# EAGLE design circuit (EAGLE 8.4.3)

## Sheet 1 of 4
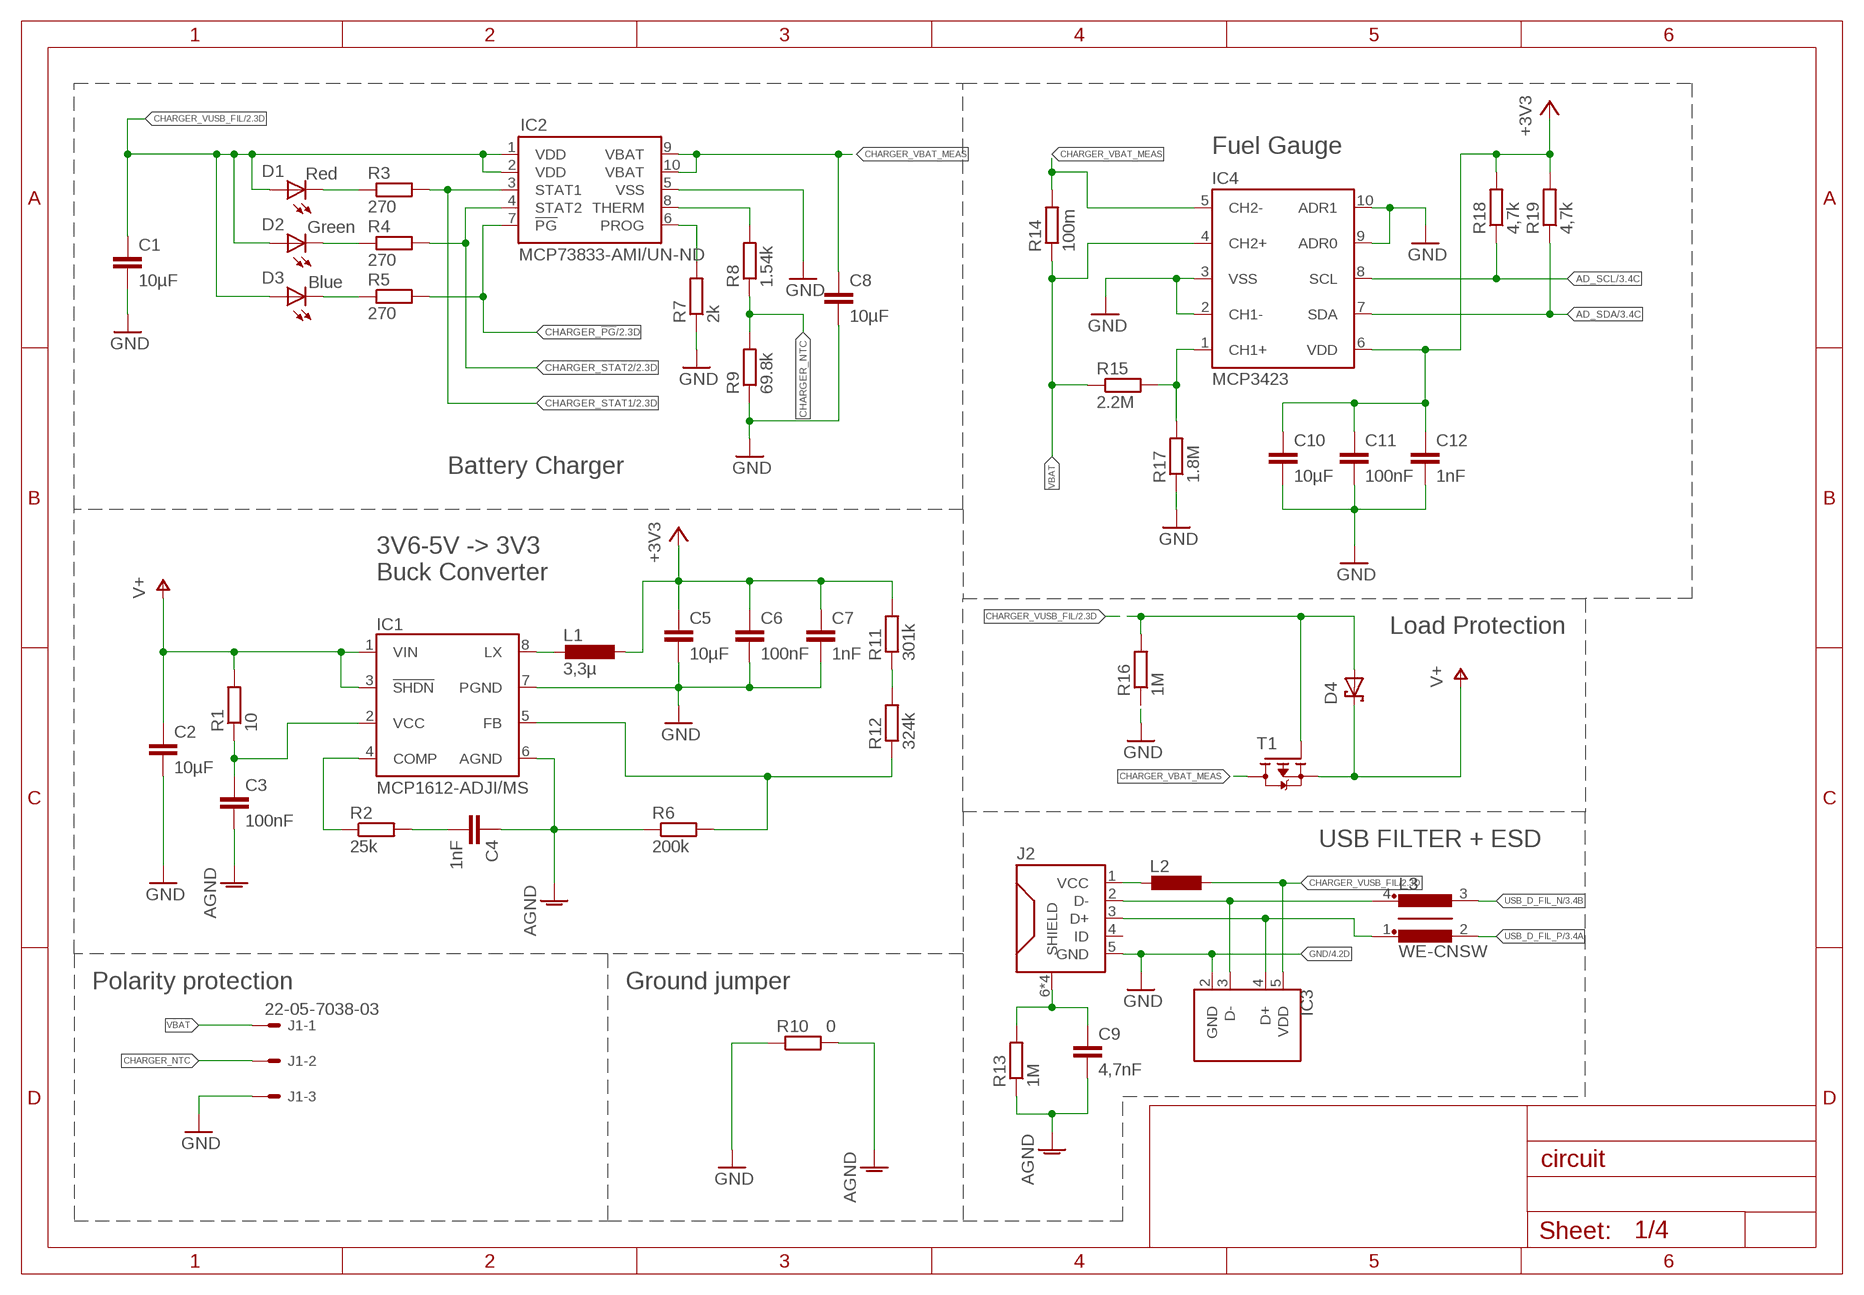
[diagram p0: schematic, sheet 1]

### Parts
C1  10µF  C-EUC0805  [C0805]
C2  10µF  C-EUC0805  [C0805]
C3  100nF  C-EUC0603  [C0603]
C4  1nF  C-EUC0603  [C0603]
C5  10µF  C-EUC0805  [C0805]
C6  100nF  C-EUC0603  [C0603]
C7  1nF  C-EUC0603  [C0603]
C8  10µF  C-EUC0805  [C0805]
C9  4,7nF  C-EUC0603  [C0603]
C10  10µF  C-EUC0805  [C0805]
C11  100nF  C-EUC0603  [C0603]
C12  1nF  C-EUC0603  [C0603]
D1  Red  LED-2012  [LED_2012]
D2  Green  LED-2012  [LED_2012]
D3  Blue  LED-2012  [LED_2012]
D4  BAT60AE6327HTSA1  [SOD323]
IC1  MCP1612-ADJI/MS  [MSOP8]
IC2  MCP73833-AMI/UN-ND  [MSOP10]
IC3  WE-TVS  [SOT23-5L]
IC4  MCP3423  [MSOP10]
J1  22-05-7038-03  [7395-03]
J2  USB2-MICRO  [USB-2-MICRO]
L1  3,3µ  WE-LHMI  [WE-LHMI]
L2  L-0603  [L0603]
L3  WE-CNSW  [WE-CNSW]
R1  10  R-EU_R0603  [R0603]
R2  25k  R-EU_R0805  [R0805]
R3  270  R-EU_R0603  [R0603]
R4  270  R-EU_R0603  [R0603]
R5  270  R-EU_R0603  [R0603]
R6  200k  R-EU_R0603  [R0603]
R7  2k  R-EU_R0603  [R0603]
R8  1.54k  R-EU_R0603  [R0603]
R9  69.8k  R-EU_R0603  [R0603]
R10  0  R-EU_R0603  [R0603]
R11  301k  R-EU_R0603  [R0603]
R12  324k  R-EU_R0603  [R0603]
R13  1M  R-EU_R0603  [R0603]
R14  100m  R-EU_R5025  [R5025]
R15  2.2M  R-EU_R0603  [R0603]
R16  1M  R-EU_R0603  [R0603]
R17  1.8M  R-EU_R0603  [R0603]
R18  4,7k  R-EU_R0603  [R0603]
R19  4,7k  R-EU_R0603  [R0603]
T1  PMOS  [SOT23]

### Nets
+3V3: C5.1 C6.1 C7.1 C10.1 C11.1 C12.1 IC4.6(VDD) L1.1 R11.2 R18.2 R19.2 ; also sheet 2,3,4
AD_CH2+: IC4.1(CH1+) R15.2 R17.2
AD_SCL: IC4.8(SCL) R18.1 ; also sheet 3,4
AD_SDA: IC4.7(SDA) R19.1 ; also sheet 3,4
AGND: C3.2 C4.1 C9.2 IC1.6(AGND) R6.1 R10.2 R13.1 ; also sheet 2,3,4
BUCK_FB: IC1.5(FB) R6.2 R12.1
BUCK_FB_R: R11.1 R12.2
BUCK_LX: IC1.8(LX) L1.2
BUCK_RC_C: C4.2 R2.2
BUCK_RC_R: IC1.4(COMP) R2.1
BUCK_V+: C2.1 D4.1(C) IC1.1(VIN) IC1.3(!SHDN!) R1.2 T1.2(S) ; supply symbol labelled V+
BUCK_VCC: C3.1 IC1.2(VCC) R1.1
CHARGER_!PG!: IC2.7(!PG) R5.2 ; also sheet 2
CHARGER_!PG!_LED: D3.1(C) R5.1
CHARGER_NTC: J1.2 R8.1 R9.2
CHARGER_PROG: IC2.6(PROG) R7.2
CHARGER_STAT1: IC2.3(STAT1) R3.2 ; also sheet 2
CHARGER_STAT1_LED: D1.1(C) R3.1
CHARGER_STAT2: IC2.4(STAT2) R4.2 ; also sheet 2
CHARGER_STAT2_LED: D2.1(C) R4.1
CHARGER_THERM: IC2.8(THERM) R8.2
CHARGER_VBAT_MEAS: C8.1 IC2.9(VBAT) IC2.10(VBAT) IC4.5(CH2-) R14.2 T1.3(D)
CHARGER_VUSB_FIL: C1.1 D1.2(A) D2.2(A) D3.2(A) D4.2(A) IC2.1(VDD) IC2.2(VDD) IC3.5(VDD) L2.1 R16.2 T1.1(G) ; also sheet 2
GND: C1.2 C2.2 C5.2 C6.2 C7.2 C8.2 C10.2 C11.2 C12.2 IC1.7(PGND) IC2.5(VSS) IC3.2(GND) IC4.2(CH1-) IC4.3(VSS) IC4.9(ADR0) IC4.10(ADR1) J1.3 J2.5(GND) R7.1 R9.1 R10.1 R16.1 R17.1 ; also sheet 2,3,4
USB_D_FIL_N [USB_DATA]: L3.3 ; also sheet 3
USB_D_FIL_P [USB_DATA]: L3.2 ; also sheet 3
USB_D_N [USB_DATA]: IC3.3(D-) J2.2(D-) L3.4
USB_D_P [USB_DATA]: IC3.4(D+) J2.3(D+) L3.1
USB_SHIELD: C9.1 J2.6(SHIELD) J2.7(SHIELD) J2.8(SHIELD) J2.9(SHIELD) R13.2
USB_VCC: J2.1(VCC) L2.2
VBAT: IC4.4(CH2+) J1.1 R14.1 R15.1
Unconnected: IC3.1 J2.4(ID)

### Notes on the sheet
- Fuel Gauge
- Battery Charger
- 3V6-5V -> 3V3
  Buck Converter
- Load Protection
- USB FILTER + ESD
- Polarity protection | Ground jumper

## Sheet 2 of 4
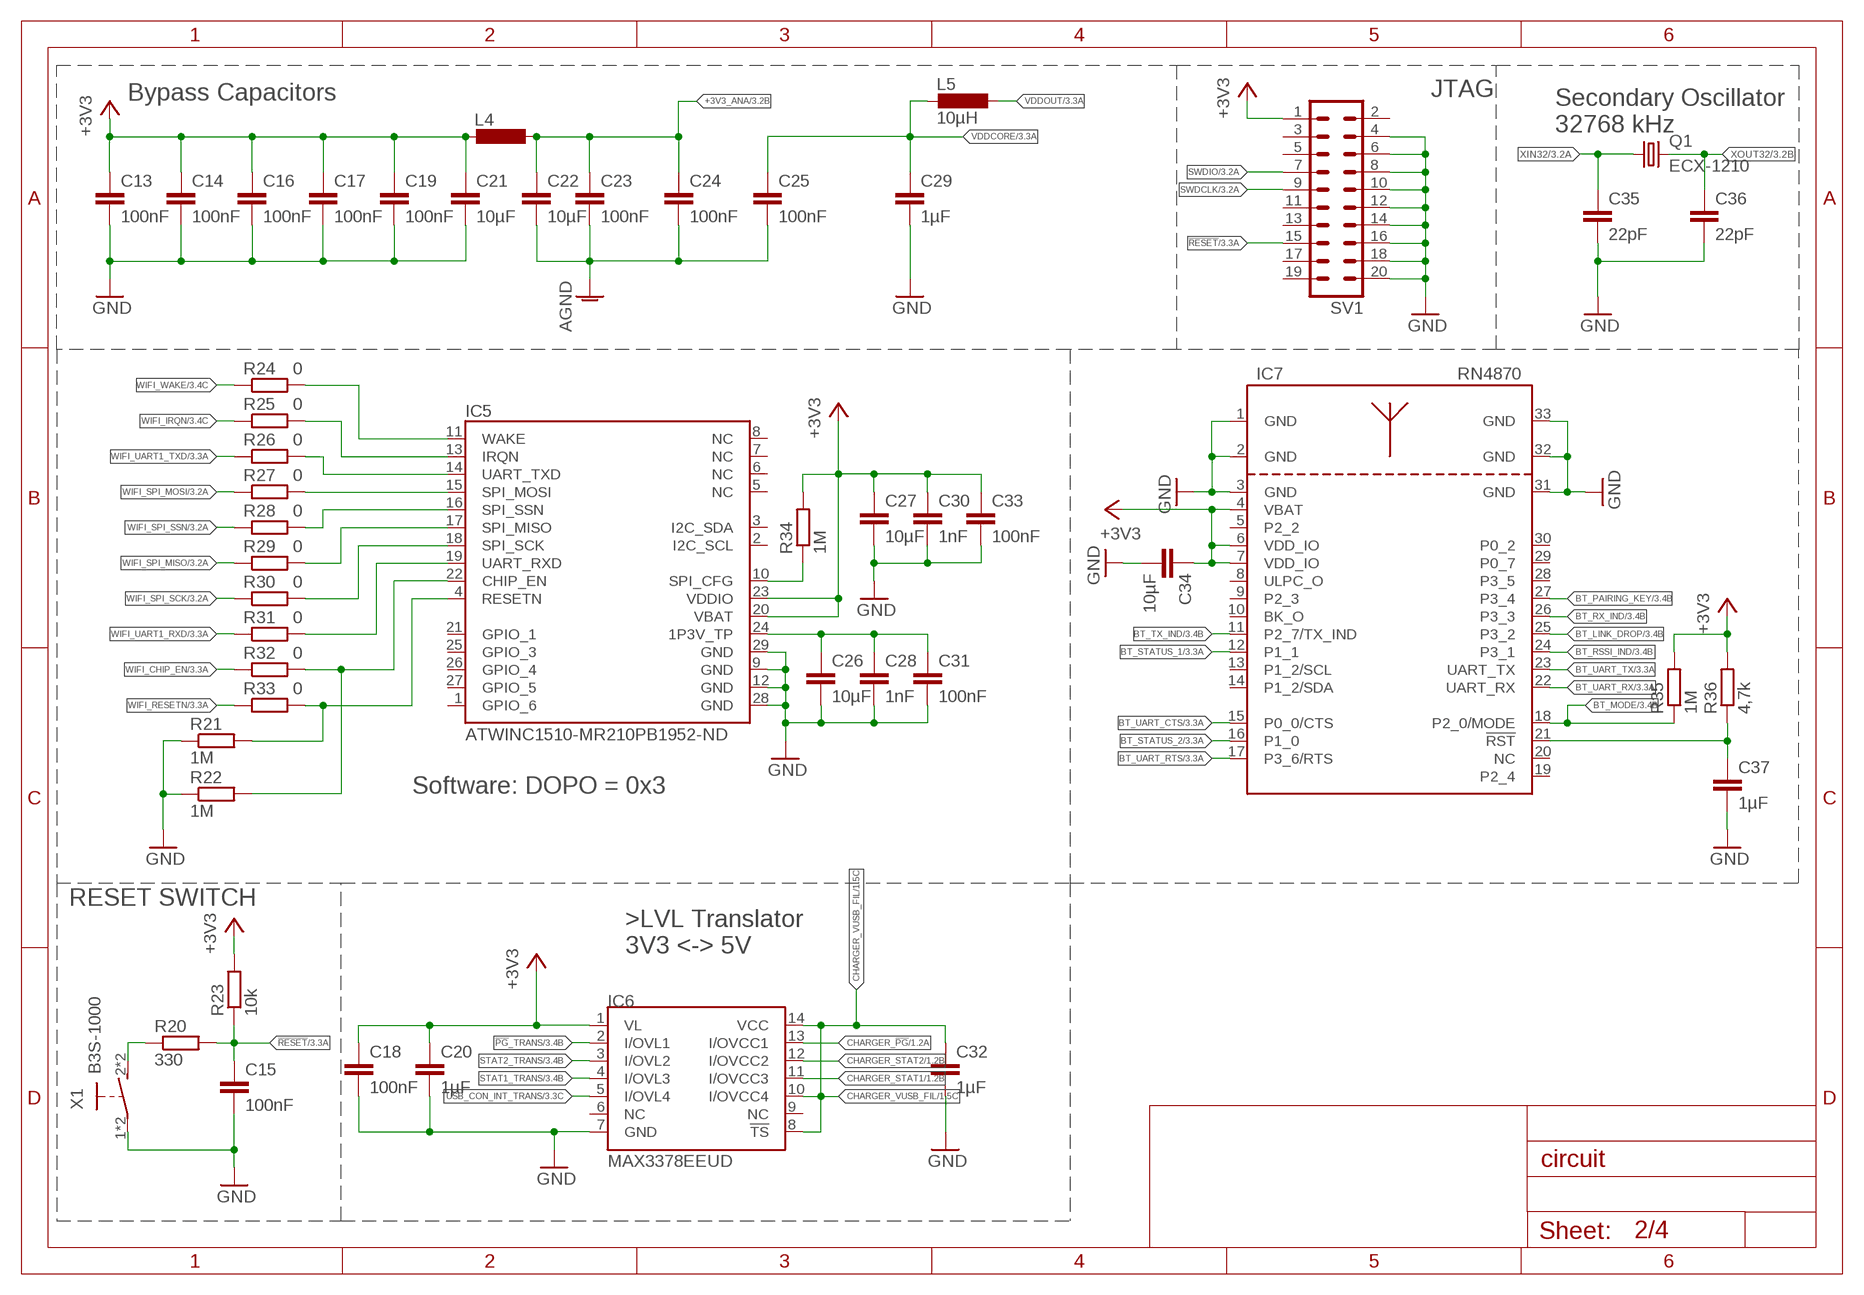
[diagram p1: schematic, sheet 2]

### Parts
C13  100nF  C-EUC0603  [C0603]
C14  100nF  C-EUC0603  [C0603]
C15  100nF  C-EUC0603  [C0603]
C16  100nF  C-EUC0603  [C0603]
C17  100nF  C-EUC0603  [C0603]
C18  100nF  C-EUC0603  [C0603]
C19  100nF  C-EUC0603  [C0603]
C20  1µF  C-EUC0603  [C0603]
C21  10µF  C-EUC0805  [C0805]
C22  10µF  C-EUC0805  [C0805]
C23  100nF  C-EUC0603  [C0603]
C24  100nF  C-EUC0603  [C0603]
C25  100nF  C-EUC0603  [C0603]
C26  10µF  C-EUC0805  [C0805]
C27  10µF  C-EUC0805  [C0805]
C28  1nF  C-EUC0603  [C0603]
C29  1µF  C-EUC0603  [C0603]
C30  1nF  C-EUC0603  [C0603]
C31  100nF  C-EUC0603  [C0603]
C32  1µF  C-EUC0603  [C0603]
C33  100nF  C-EUC0603  [C0603]
C34  10µF  C-EUC0805  [C0805]
C35  22pF  C-EUC0603  [C0603]
C36  22pF  C-EUC0603  [C0603]
C37  1µF  C-EUC0603  [C0603]
IC5  ATWINC1510-MR210PB1952-ND  [ATWINC15X0-MODULE]
IC6  MAX3378EEUD  [TSSOP14]
IC7  RN4870  [RN4870-MODULE]
L4  L-0603  [L0603]
L5  10µH  L-1210  [L-1210]
Q1  ECX-1210  [ECX-1210]
R20  330  R-EU_R0603  [R0603]
R21  1M  R-EU_R0603  [R0603]
R22  1M  R-EU_R0603  [R0603]
R23  10k  R-EU_R0603  [R0603]
R24  0  R-EU_R0603  [R0603]
R25  0  R-EU_R0603  [R0603]
R26  0  R-EU_R0603  [R0603]
R27  0  R-EU_R0603  [R0603]
R28  0  R-EU_R0603  [R0603]
R29  0  R-EU_R0603  [R0603]
R30  0  R-EU_R0603  [R0603]
R31  0  R-EU_R0603  [R0603]
R32  0  R-EU_R0603  [R0603]
R33  0  R-EU_R0603  [R0603]
R34  1M  R-EU_R0603  [R0603]
R35  1M  R-EU_R0603  [R0603]
R36  4,7k  R-EU_R0603  [R0603]
SV1  JTAGEDU  ML20  [ML20]
X1  B3S-1000  [B3S]

### Nets
!PG!_TRANS: IC6.2(I/OVL1) ; also sheet 3
!RESET!: C15.1 R20.2 R23.1 SV1.15 ; also sheet 3
!RESET!_B: R20.1 X1.2(S) X1.4(S)
+3V3: C13.1 C14.1 C16.1 C17.1 C18.1 C19.1 C20.1 C21.1 C27.1 C30.1 C33.1 C34.1 IC5.20(VBAT) IC5.23(VDDIO) IC6.1(VL) IC7.4(VBAT) IC7.6(VDD_IO) IC7.7(VDD_IO) L4.2 R23.2 R34.2 R35.2 R36.2 SV1.1 ; also sheet 1,3,4
+3V3_ANA: C22.1 C23.1 C24.1 L4.1 ; also sheet 3,4
AGND: C22.2 C23.2 C24.2 C25.2 ; also sheet 1,3,4
BT_!RESET!: C37.1 IC7.21(!RST!) R36.1
BT_LINK_DROP: IC7.25(P3_2) ; also sheet 3
BT_MODE: IC7.18(P2_0/MODE) R35.1 ; also sheet 3
BT_PAIRING_KEY: IC7.27(P3_4) ; also sheet 3
BT_RSSI_IND: IC7.24(P3_1) ; also sheet 3
BT_RX_IND: IC7.26(P3_3) ; also sheet 3
BT_STATUS_1: IC7.12(P1_1) ; also sheet 3
BT_STATUS_2: IC7.16(P1_0) ; also sheet 3
BT_TX_IND: IC7.11(P2_7/TX_IND) ; also sheet 3
BT_UART_CTS: IC7.15(P0_0/CTS) ; also sheet 3,4
BT_UART_RTS: IC7.17(P3_6/RTS) ; also sheet 3,4
BT_UART_RX: IC7.22(UART_RX) ; also sheet 3,4
BT_UART_TX: IC7.23(UART_TX) ; also sheet 3,4
CHARGER_!PG!: IC6.13(I/OVCC1) ; also sheet 1
CHARGER_STAT1: IC6.11(I/OVCC3) ; also sheet 1
CHARGER_STAT2: IC6.12(I/OVCC2) ; also sheet 1
CHARGER_VUSB_FIL: C32.1 IC6.8(!TS!) IC6.10(I/OVCC4) IC6.14(VCC) ; also sheet 1
GND: C13.2 C14.2 C15.2 C16.2 C17.2 C18.2 C19.2 C20.2 C21.2 C26.2 C27.2 C28.2 C29.2 C30.2 C31.2 C32.2 C33.2 C34.2 C35.2 C36.2 C37.2 IC5.9(GND) IC5.12(GND) IC5.28(GND) IC5.29(GND) IC6.7(GND) IC7.1(GND) IC7.2(GND) IC7.3(GND) IC7.31(GND) IC7.32(GND) IC7.33(GND) R21.1 R22.1 SV1.4 SV1.6 SV1.8 SV1.10 SV1.12 SV1.14 SV1.16 SV1.18 SV1.20 X1.1(P) X1.3(P) ; also sheet 1,3,4
STAT1_TRANS: IC6.4(I/OVL3) ; also sheet 3
STAT2_TRANS: IC6.3(I/OVL2) ; also sheet 3
SWDCLK: SV1.9 ; also sheet 3
SWDIO: SV1.7 ; also sheet 3
USB_CON_INT_TRANS: IC6.5(I/OVL4) ; also sheet 3
VDDCORE: C25.1 C29.1 L5.2 ; also sheet 3
VDDOUT: L5.1 ; also sheet 3
WIFI_1P3V_TP: C26.1 C28.1 C31.1 IC5.24(1P3V_TP)
WIFI_CHIP_EN: R32.1 ; also sheet 3
WIFI_CHIP_EN_D: IC5.22(CHIP_EN) R22.2 R32.2
WIFI_IRQN: R25.1 ; also sheet 3
WIFI_IRQN_D: IC5.13(IRQN) R25.2
WIFI_RESETN: R33.1 ; also sheet 3
WIFI_RESETN_D: IC5.4(RESETN) R21.2 R33.2
WIFI_SPI_CFG: IC5.10(SPI_CFG) R34.1
WIFI_SPI_MISO: R29.1 ; also sheet 3,4
WIFI_SPI_MISO_D: IC5.17(SPI_MISO) R29.2
WIFI_SPI_MOSI: R27.1 ; also sheet 3,4
WIFI_SPI_MOSI_D: IC5.15(SPI_MOSI) R27.2
WIFI_SPI_SCK: R30.1 ; also sheet 3,4
WIFI_SPI_SCK_D: IC5.18(SPI_SCK) R30.2
WIFI_SPI_SSN: R28.1 ; also sheet 3,4
WIFI_SPI_SSN_D: IC5.16(SPI_SSN) R28.2
WIFI_UART1_RXD: R31.1 ; also sheet 3,4
WIFI_UART1_RXD_D: IC5.19(UART_RXD) R31.2
WIFI_UART1_TXD: R26.1 ; also sheet 3,4
WIFI_UART1_TXD_D: IC5.14(UART_TXD) R26.2
WIFI_WAKE: R24.1 ; also sheet 3
WIFI_WAKE_D: IC5.11(WAKE) R24.2
XIN32: C35.1 Q1.1 ; also sheet 3
XOUT32: C36.1 Q1.2 ; also sheet 3
Unconnected: IC5.1(GPIO_6) IC5.2(I2C_SCL) IC5.3(I2C_SDA) IC5.5(NC) IC5.6(NC) IC5.7(NC) IC5.8(NC) IC5.21(GPIO_1) IC5.25(GPIO_3) IC5.26(GPIO_4) IC5.27(GPIO_5) IC6.6(NC) IC6.9(NC) IC7.5(P2_2) IC7.8(ULPC_O) IC7.9(P2_3) IC7.10(BK_O) IC7.13(P1_2/SCL) IC7.14(P1_2/SDA) IC7.19(P2_4) IC7.20(NC) IC7.28(P3_5) IC7.29(P0_7) IC7.30(P0_2) SV1.2 SV1.3 SV1.5 SV1.11 SV1.13 SV1.17 SV1.19

### Notes on the sheet
- Bypass Capacitors | JTAG
- Secondary Oscillator
  32768 kHz
- Software: DOPO = 0x3
- RESET SWITCH
- >LVL Translator
  3V3 <-> 5V

## Sheet 3 of 4
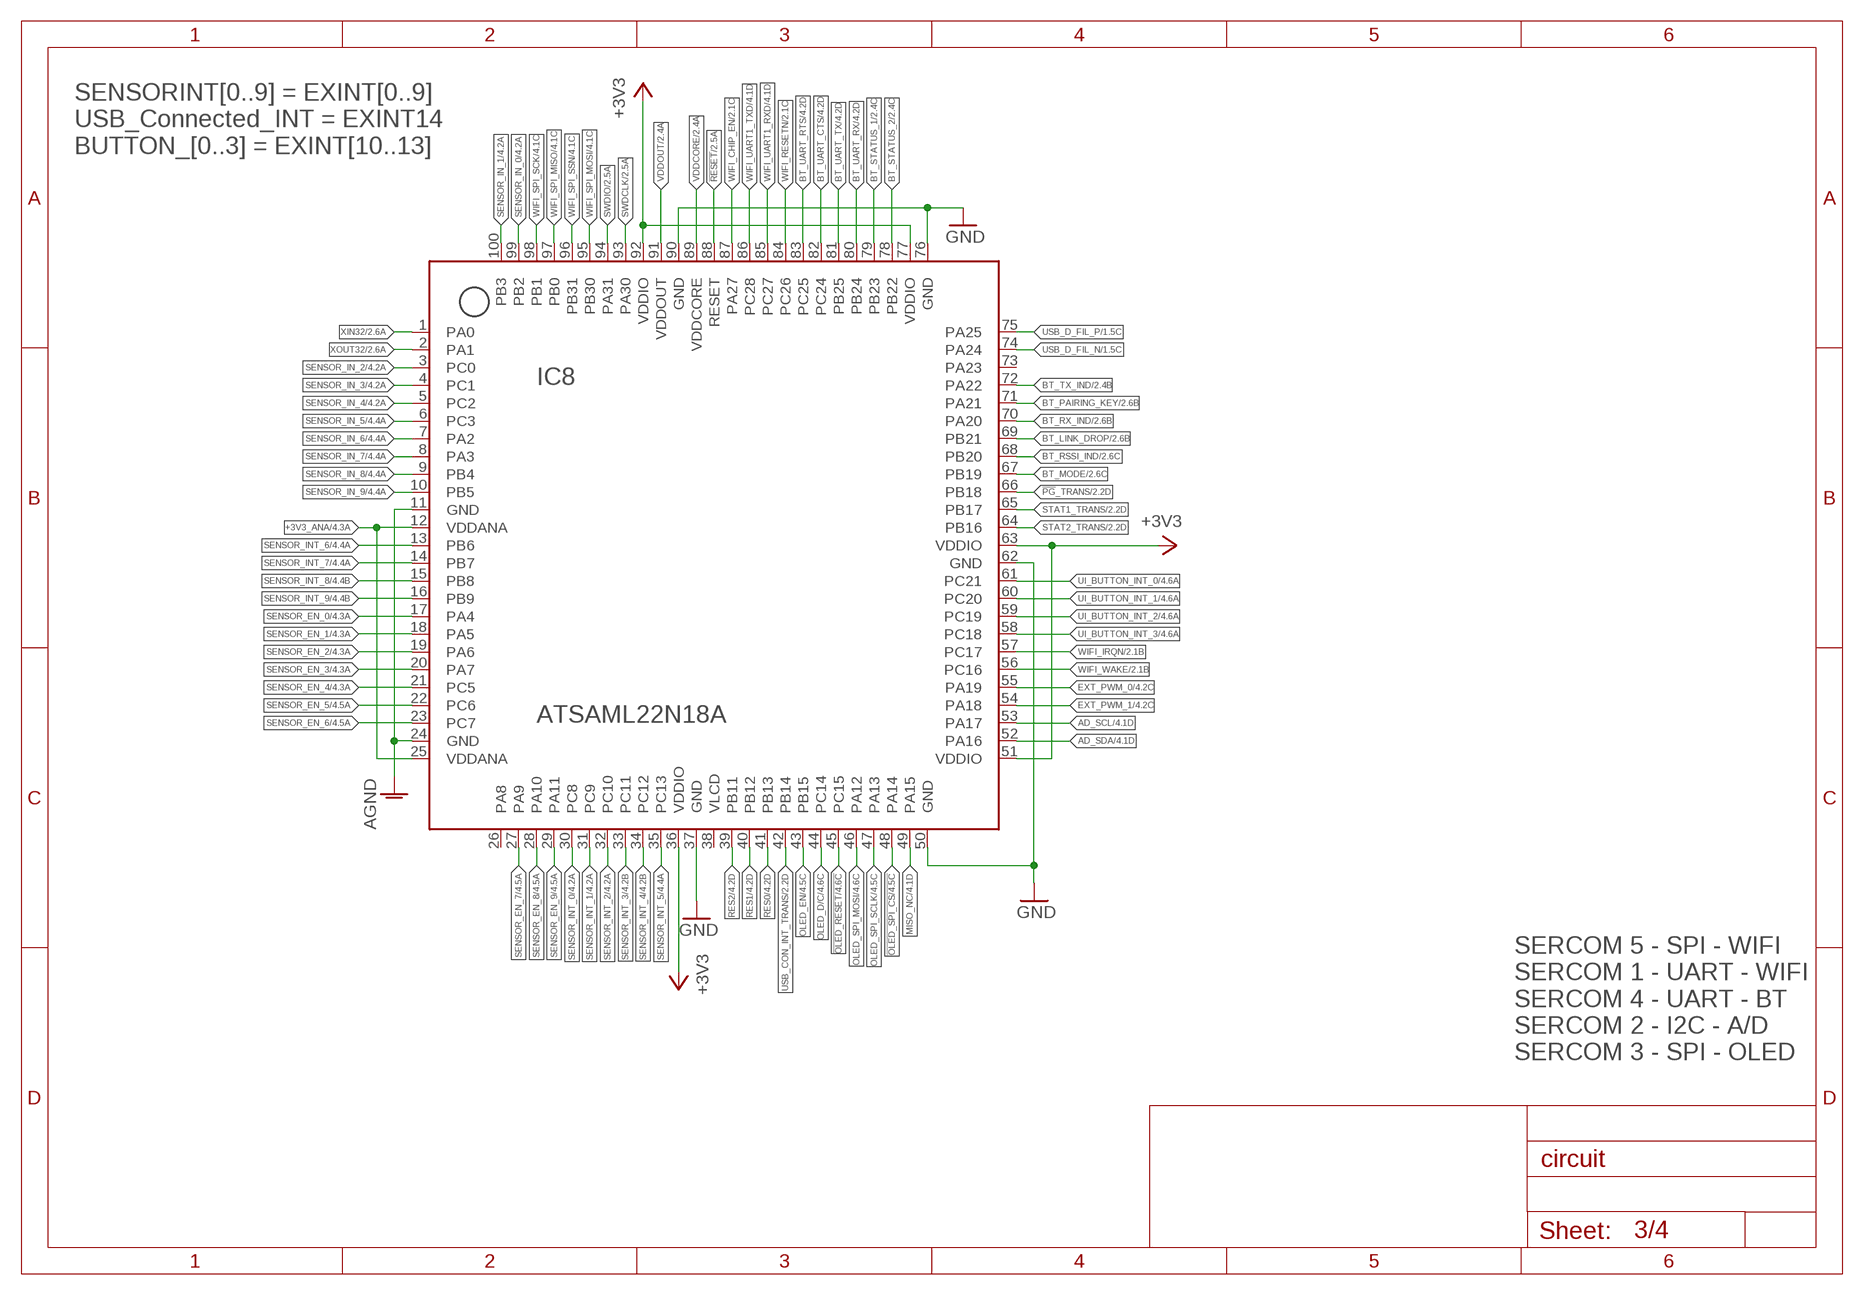
[diagram p2: schematic, sheet 3]

### Parts
IC8  ATSAML22N18A  [TQFP100]

### Nets
!OLED_RESET: IC8.45(PC15) ; also sheet 4
!OLED_SPI_CS: IC8.48(PA14) ; also sheet 4
!PG!_TRANS: IC8.66(PB18) ; also sheet 2
!RESET!: IC8.88(RESET) ; also sheet 2
+3V3: IC8.36(VDDIO) IC8.51(VDDIO) IC8.63(VDDIO) IC8.77(VDDIO) IC8.92(VDDIO) ; also sheet 1,2,4
+3V3_ANA: IC8.12(VDDANA) IC8.25(VDDANA) ; also sheet 2,4
AD_SCL: IC8.53(PA17) ; also sheet 1,4
AD_SDA: IC8.52(PA16) ; also sheet 1,4
AGND: IC8.11(GND) IC8.24(GND) ; also sheet 1,2,4
BT_LINK_DROP: IC8.69(PB21) ; also sheet 2
BT_MODE: IC8.67(PB19) ; also sheet 2
BT_PAIRING_KEY: IC8.71(PA21) ; also sheet 2
BT_RSSI_IND: IC8.68(PB20) ; also sheet 2
BT_RX_IND: IC8.70(PA20) ; also sheet 2
BT_STATUS_1: IC8.79(PB23) ; also sheet 2
BT_STATUS_2: IC8.78(PB22) ; also sheet 2
BT_TX_IND: IC8.72(PA22) ; also sheet 2
BT_UART_CTS: IC8.82(PC24) ; also sheet 2,4
BT_UART_RTS: IC8.83(PC25) ; also sheet 2,4
BT_UART_RX: IC8.80(PB24) ; also sheet 2,4
BT_UART_TX: IC8.81(PB25) ; also sheet 2,4
EXT_PWM_0: IC8.55(PA19) ; also sheet 4
EXT_PWM_1: IC8.54(PA18) ; also sheet 4
GND: IC8.37(GND) IC8.50(GND) IC8.62(GND) IC8.76(GND) IC8.90(GND) ; also sheet 1,2,4
MISO_NC: IC8.49(PA15) ; also sheet 4
OLED_D/C: IC8.44(PC14) ; also sheet 4
OLED_EN: IC8.43(PB15) ; also sheet 4
OLED_SPI_MOSI: IC8.46(PA12) ; also sheet 4
OLED_SPI_SCLK: IC8.47(PA13) ; also sheet 4
RES0: IC8.41(PB13) ; also sheet 4
RES1: IC8.40(PB12) ; also sheet 4
RES2: IC8.39(PB11) ; also sheet 4
SENSOR_EN_0: IC8.17(PA4) ; also sheet 4
SENSOR_EN_1: IC8.18(PA5) ; also sheet 4
SENSOR_EN_2: IC8.19(PA6) ; also sheet 4
SENSOR_EN_3: IC8.20(PA7) ; also sheet 4
SENSOR_EN_4: IC8.21(PC5) ; also sheet 4
SENSOR_EN_5: IC8.22(PC6) ; also sheet 4
SENSOR_EN_6: IC8.23(PC7) ; also sheet 4
SENSOR_EN_7: IC8.27(PA9) ; also sheet 4
SENSOR_EN_8: IC8.28(PA10) ; also sheet 4
SENSOR_EN_9: IC8.29(PA11) ; also sheet 4
SENSOR_IN_0: IC8.99(PB2) ; also sheet 4
SENSOR_IN_1: IC8.100(PB3) ; also sheet 4
SENSOR_IN_2: IC8.3(PC0) ; also sheet 4
SENSOR_IN_3: IC8.4(PC1) ; also sheet 4
SENSOR_IN_4: IC8.5(PC2) ; also sheet 4
SENSOR_IN_5: IC8.6(PC3) ; also sheet 4
SENSOR_IN_6: IC8.7(PA2) ; also sheet 4
SENSOR_IN_7: IC8.8(PA3) ; also sheet 4
SENSOR_IN_8: IC8.9(PB4) ; also sheet 4
SENSOR_IN_9: IC8.10(PB5) ; also sheet 4
SENSOR_INT_0: IC8.30(PC8) ; also sheet 4
SENSOR_INT_1: IC8.31(PC9) ; also sheet 4
SENSOR_INT_2: IC8.32(PC10) ; also sheet 4
SENSOR_INT_3: IC8.33(PC11) ; also sheet 4
SENSOR_INT_4: IC8.34(PC12) ; also sheet 4
SENSOR_INT_5: IC8.35(PC13) ; also sheet 4
SENSOR_INT_6: IC8.13(PB6) ; also sheet 4
SENSOR_INT_7: IC8.14(PB7) ; also sheet 4
SENSOR_INT_8: IC8.15(PB8) ; also sheet 4
SENSOR_INT_9: IC8.16(PB9) ; also sheet 4
STAT1_TRANS: IC8.65(PB17) ; also sheet 2
STAT2_TRANS: IC8.64(PB16) ; also sheet 2
SWDCLK: IC8.93(PA30) ; also sheet 2
SWDIO: IC8.94(PA31) ; also sheet 2
UI_BUTTON_INT_0: IC8.61(PC21) ; also sheet 4
UI_BUTTON_INT_1: IC8.60(PC20) ; also sheet 4
UI_BUTTON_INT_2: IC8.59(PC19) ; also sheet 4
UI_BUTTON_INT_3: IC8.58(PC18) ; also sheet 4
USB_CON_INT_TRANS: IC8.42(PB14) ; also sheet 2
USB_D_FIL_N [USB_DATA]: IC8.74(PA24) ; also sheet 1
USB_D_FIL_P [USB_DATA]: IC8.75(PA25) ; also sheet 1
VDDCORE: IC8.89(VDDCORE) ; also sheet 2
VDDOUT: IC8.91(VDDOUT) ; also sheet 2
WIFI_CHIP_EN: IC8.87(PA27) ; also sheet 2
WIFI_IRQN: IC8.57(PC17) ; also sheet 2
WIFI_RESETN: IC8.84(PC26) ; also sheet 2
WIFI_SPI_MISO: IC8.97(PB0) ; also sheet 2,4
WIFI_SPI_MOSI: IC8.95(PB30) ; also sheet 2,4
WIFI_SPI_SCK: IC8.98(PB1) ; also sheet 2,4
WIFI_SPI_SSN: IC8.96(PB31) ; also sheet 2,4
WIFI_UART1_RXD: IC8.85(PC27) ; also sheet 2,4
WIFI_UART1_TXD: IC8.86(PC28) ; also sheet 2,4
WIFI_WAKE: IC8.56(PC16) ; also sheet 2
XIN32: IC8.1(PA0) ; also sheet 2
XOUT32: IC8.2(PA1) ; also sheet 2
Unconnected: IC8.26(PA8) IC8.38(VLCD) IC8.73(PA23)

### Notes on the sheet
- SENSORINT[0..9] = EXINT[0..9] 
  USB_Connected_INT = EXINT14
  BUTTON_[0..3] = EXINT[10..13]
- SERCOM 5 - SPI - WIFI
  SERCOM 1 - UART - WIFI
  SERCOM 4 - UART - BT
  SERCOM 2 - I2C - A/D
  SERCOM 3 - SPI - OLED

## Sheet 4 of 4
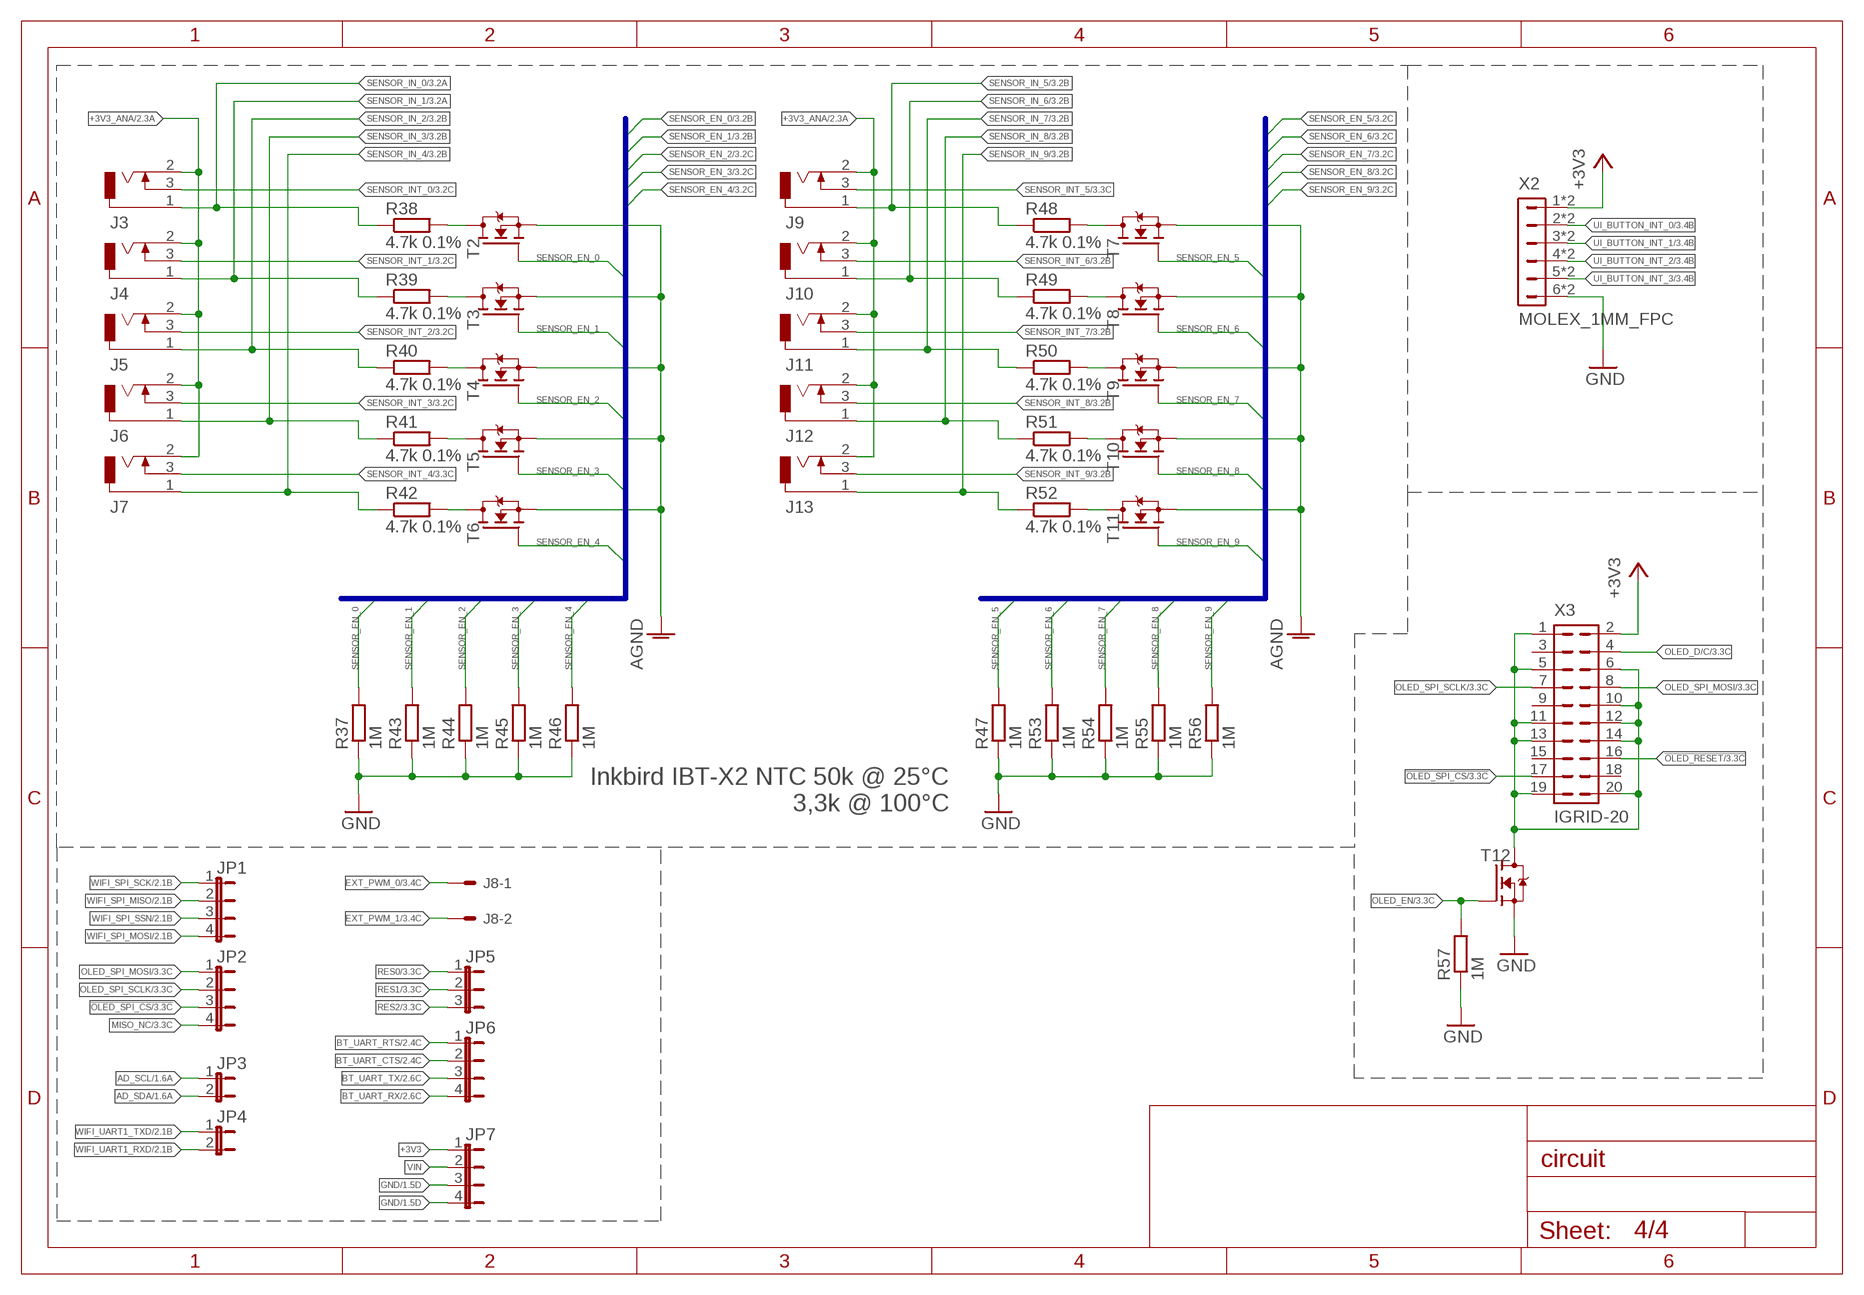
[diagram p3: schematic, sheet 4]

### Parts
J3  2.5MM-AUDIO-JACK-MONO  [2.5MM-AUDIO-JACK-MONO]
J4  2.5MM-AUDIO-JACK-MONO  [2.5MM-AUDIO-JACK-MONO]
J5  2.5MM-AUDIO-JACK-MONO  [2.5MM-AUDIO-JACK-MONO]
J6  2.5MM-AUDIO-JACK-MONO  [2.5MM-AUDIO-JACK-MONO]
J7  2.5MM-AUDIO-JACK-MONO  [2.5MM-AUDIO-JACK-MONO]
J8  22-05-7028-02  [7395-02]
J9  2.5MM-AUDIO-JACK-MONONO_DRILL  [2.5MM-AUDIO-JACK-MONO-2]
J10  2.5MM-AUDIO-JACK-MONONO_DRILL  [2.5MM-AUDIO-JACK-MONO-2]
J11  2.5MM-AUDIO-JACK-MONONO_DRILL  [2.5MM-AUDIO-JACK-MONO-2]
J12  2.5MM-AUDIO-JACK-MONONO_DRILL  [2.5MM-AUDIO-JACK-MONO-2]
J13  2.5MM-AUDIO-JACK-MONONO_DRILL  [2.5MM-AUDIO-JACK-MONO-2]
JP1  4  JP4E  [JP4]
JP2  4  JP4E  [JP4]
JP3  2  JP1E  [JP1]
JP4  2  JP1E  [JP1]
JP5  3  JP2E  [JP2]
JP6  4  JP4E  [JP4]
JP7  4  JP4E  [JP4]
R37  1M  R-EU_R0603  [R0603]
R38  4.7k 0.1%  R-EU_R0603  [R0603]
R39  4.7k 0.1%  R-EU_R0603  [R0603]
R40  4.7k 0.1%  R-EU_R0603  [R0603]
R41  4.7k 0.1%  R-EU_R0603  [R0603]
R42  4.7k 0.1%  R-EU_R0603  [R0603]
R43  1M  R-EU_R0603  [R0603]
R44  1M  R-EU_R0603  [R0603]
R45  1M  R-EU_R0603  [R0603]
R46  1M  R-EU_R0603  [R0603]
R47  1M  R-EU_R0603  [R0603]
R48  4.7k 0.1%  R-EU_R0603  [R0603]
R49  4.7k 0.1%  R-EU_R0603  [R0603]
R50  4.7k 0.1%  R-EU_R0603  [R0603]
R51  4.7k 0.1%  R-EU_R0603  [R0603]
R52  4.7k 0.1%  R-EU_R0603  [R0603]
R53  1M  R-EU_R0603  [R0603]
R54  1M  R-EU_R0603  [R0603]
R55  1M  R-EU_R0603  [R0603]
R56  1M  R-EU_R0603  [R0603]
R57  1M  R-EU_R0603  [R0603]
T2  NMOSSOT323  [SOT-323]
T3  NMOSSOT323  [SOT-323]
T4  NMOSSOT323  [SOT-323]
T5  NMOSSOT323  [SOT-323]
T6  NMOSSOT323  [SOT-323]
T7  NMOSSOT323  [SOT-323]
T8  NMOSSOT323  [SOT-323]
T9  NMOSSOT323  [SOT-323]
T10  NMOSSOT323  [SOT-323]
T11  NMOSSOT323  [SOT-323]
T12  NMOSSOT323  [SOT-323]
X2  MOLEX_1MM_FPC  [1MM_FPC_ZIF]
X3  IGRID-20  [I-GRID-20]

### Nets
!OLED_RESET: X3.16 ; also sheet 3
!OLED_SPI_CS: JP2.3 X3.17 ; also sheet 3
+3V3: JP7.1 X2.1 X2.7 X3.2 ; also sheet 1,2,3
+3V3_ANA: J3.2 J4.2 J5.2 J6.2 J7.2 J9.2 J10.2 J11.2 J12.2 J13.2 ; also sheet 2,3
AD_SCL: JP3.1 ; also sheet 1,3
AD_SDA: JP3.2 ; also sheet 1,3
AGND: T2.2(S) T3.2(S) T4.2(S) T5.2(S) T6.2(S) T7.2(S) T8.2(S) T9.2(S) T10.2(S) T11.2(S) ; also sheet 1,2,3
BT_UART_CTS: JP6.2 ; also sheet 2,3
BT_UART_RTS: JP6.1 ; also sheet 2,3
BT_UART_RX: JP6.4 ; also sheet 2,3
BT_UART_TX: JP6.3 ; also sheet 2,3
EXT_PWM_0: J8.1 ; also sheet 3
EXT_PWM_1: J8.2 ; also sheet 3
GND: JP7.3 JP7.4 R37.1 R43.1 R44.1 R45.1 R46.1 R47.1 R53.1 R54.1 R55.1 R56.1 R57.1 T12.2(S) X2.6 X2.12 ; also sheet 1,2,3
MISO_NC: JP2.4 ; also sheet 3
OLED_D/C: X3.4 ; also sheet 3
OLED_EN: R57.2 T12.1(G) ; also sheet 3
OLED_EN_DRAIN: T12.3(D) X3.1 X3.5 X3.6 X3.10 X3.11 X3.12 X3.13 X3.14 X3.19 X3.20
OLED_SPI_MOSI: JP2.1 X3.8 ; also sheet 3
OLED_SPI_SCLK: JP2.2 X3.7 ; also sheet 3
RES0: JP5.1 ; also sheet 3
RES1: JP5.2 ; also sheet 3
RES2: JP5.3 ; also sheet 3
SENSOR_EN_0: R37.2 T2.1(G) ; also sheet 3
SENSOR_EN_1: R43.2 T3.1(G) ; also sheet 3
SENSOR_EN_2: R44.2 T4.1(G) ; also sheet 3
SENSOR_EN_3: R45.2 T5.1(G) ; also sheet 3
SENSOR_EN_4: R46.2 T6.1(G) ; also sheet 3
SENSOR_EN_5: R47.2 T7.1(G) ; also sheet 3
SENSOR_EN_6: R53.2 T8.1(G) ; also sheet 3
SENSOR_EN_7: R54.2 T9.1(G) ; also sheet 3
SENSOR_EN_8: R55.2 T10.1(G) ; also sheet 3
SENSOR_EN_9: R56.2 T11.1(G) ; also sheet 3
SENSOR_IN_0: J3.1 R38.1 ; also sheet 3
SENSOR_IN_0_DRAIN: R38.2 T2.3(D)
SENSOR_IN_1: J4.1 R39.1 ; also sheet 3
SENSOR_IN_1_DRAIN: R39.2 T3.3(D)
SENSOR_IN_2: J5.1 R40.1 ; also sheet 3
SENSOR_IN_2_DRAIN: R40.2 T4.3(D)
SENSOR_IN_3: J6.1 R41.1 ; also sheet 3
SENSOR_IN_3_DRAIN: R41.2 T5.3(D)
SENSOR_IN_4: J7.1 R42.1 ; also sheet 3
SENSOR_IN_4_DRAIN: R42.2 T6.3(D)
SENSOR_IN_5: J9.1 R48.1 ; also sheet 3
SENSOR_IN_5_DRAIN: R48.2 T7.3(D)
SENSOR_IN_6: J10.1 R49.1 ; also sheet 3
SENSOR_IN_6_DRAIN: R49.2 T8.3(D)
SENSOR_IN_7: J11.1 R50.1 ; also sheet 3
SENSOR_IN_7_DRAIN: R50.2 T9.3(D)
SENSOR_IN_8: J12.1 R51.1 ; also sheet 3
SENSOR_IN_8_DRAIN: R51.2 T10.3(D)
SENSOR_IN_9: J13.1 R52.1 ; also sheet 3
SENSOR_IN_9_DRAIN: R52.2 T11.3(D)
SENSOR_INT_0: J3.3 ; also sheet 3
SENSOR_INT_1: J4.3 ; also sheet 3
SENSOR_INT_2: J5.3 ; also sheet 3
SENSOR_INT_3: J6.3 ; also sheet 3
SENSOR_INT_4: J7.3 ; also sheet 3
SENSOR_INT_5: J9.3 ; also sheet 3
SENSOR_INT_6: J10.3 ; also sheet 3
SENSOR_INT_7: J11.3 ; also sheet 3
SENSOR_INT_8: J12.3 ; also sheet 3
SENSOR_INT_9: J13.3 ; also sheet 3
UI_BUTTON_INT_0: X2.2 X2.8 ; also sheet 3
UI_BUTTON_INT_1: X2.3 X2.9 ; also sheet 3
UI_BUTTON_INT_2: X2.4 X2.10 ; also sheet 3
UI_BUTTON_INT_3: X2.5 X2.11 ; also sheet 3
VIN: JP7.2
WIFI_SPI_MISO: JP1.2 ; also sheet 2,3
WIFI_SPI_MOSI: JP1.4 ; also sheet 2,3
WIFI_SPI_SCK: JP1.1 ; also sheet 2,3
WIFI_SPI_SSN: JP1.3 ; also sheet 2,3
WIFI_UART1_RXD: JP4.2 ; also sheet 2,3
WIFI_UART1_TXD: JP4.1 ; also sheet 2,3
Unconnected: X3.3 X3.9 X3.15 X3.18

### Buses
SENSOR_EN_[0..4]
SENSOR_EN_[5..9]

### Notes on the sheet
- Inkbird IBT-X2 NTC 50k @ 25°C
                               3,3k @ 100°C

## Library data of the parts
C1 C2 C5 C8 C10 C21 C22 C26 C27 C34 = rcl:C-EU: CAPACITOR, European symbol; OC_MOUSER: 81-GRM21BR61E106KA3L
C3 C6 C11 C13-C19 C23-C25 C31 C33 = rcl:C-EU: CAPACITOR, European symbol; OC_MOUSER: 581-06033C104KAT2A
C4 C7 C12 C28 C30 = rcl:C-EU: CAPACITOR, European symbol; OC_MOUSER: 80-C0603C102K3R
C9 = rcl:C-EU: CAPACITOR, European symbol; OC_MOUSER: 80-C0603C472K3R
C20 C29 C32 C37 = rcl:C-EU: CAPACITOR, European symbol; OC_MOUSER: 810-CGA3E1X7R1E105AC
C35 C36 = rcl:C-EU: CAPACITOR, European symbol; OC_MOUSER: 581-02013A220FAT2A
D1 = Thermo_Library:LED-2012; OC_MOUSER: 630-HSMC-C170-T0000
D2 = Thermo_Library:LED-2012; OC_MOUSER: 630-HSMQ-C170-T0000
D3 = Thermo_Library:LED-2012; OC_MOUSER: 630-HSMR-C170-R0000
D4 = Thermo_Library:BAT60AE6327HTSA1; OC_MOUSER: 726-BAT60AE6327HTSA1
IC1 = thermo:MCP1612-ADJI/MS
IC2 = thermo:MCP73833-AMI/UN-ND
IC3 = thermo:WE-TVS; OC_MOUSER: 710-824011
IC4 = thermo:MCP3423
IC5 = thermo:ATWINC1510-MR210PB1952-ND: The ATWINC15x0-MR210xB is a low-power consumption 802.11 b/g/n IoT (Internet of Things) module, which is specifically optimized for low-power IoT applications. The module integrates Power Amplifier, LNA, Switch, Power Management, and a choice of printed antenna or a micro co-ax (u.FL) connector for an external antenna resulting in a small form factor (21.7x14.7x2.1mm) design. With seamless roaming capabilities and advanced security, it could be interoperable with various vendors’ 802.11 b/g/n access points in wireless LAN. The module provides SPI ports to interface with a host controller.
IC6 = thermo:MAX3378EEUD; OC_MOUSER: 700-MAX3378EEUD
IC7 = thermo:RN4870
IC8 = thermo:ATSAML22N18A: The ultra-low-power ATSAML22 based Flash microcontrollers (MCU) feature sophisticated power management technologies and consumes 39 µA/MHz (CPU running CoreMark) in active mode and down to 490nA in ultra low-power backup mode with RTC. In addition to ultra-low-power performance, these devices feature Segment LCD controller, tamper detection, smart card interface, Full Speed USB device, Event System and Sleepwalking, 12-bit analog, AES, capacitive touch sensing and much more.
J1 = con-molex:22-?-03: CONNECTOR wire to board 2.54 mm (.1 inch) pitch header; OC_FARNELL: unknown; OC_NEWARK: unknown
J2 = thermo:USB2-MICRO: 10104110-0001LF - USB-Steckverbinder, Micro-USB Typ B, USB 2.0, Buchse, 5 -polig, Oberflächenmontage, Rechtwinklig; OC_MOUSER: 649-10104110-0001LF
J3-J7 = Thermo_Library:2.5MM-AUDIO-JACK-MONO; OC_MOUSER: 490-MJ-2523-SMT-TR
J8 = con-molex:22-?-02: CONNECTOR wire to board 2.54 mm (.1 inch) pitch header; OC_MOUSER: 538-22-05-7028; OC_NEWARK: unknown
J9-J13 = thermo:2.5MM-AUDIO-JACK-MONO
JP1 JP2 JP6 JP7 = jumper:JP4E: JUMPER; OC_MOUSER: 855-M20-9770446
JP3 JP4 = jumper:JP1E: JUMPER; OC_MOUSER: 855-M20-9990246
JP5 = jumper:JP2E: JUMPER; OC_FARNELL: 710-61300311121
L1 = Thermo_Library:WE-LHMI; OC_MOUSER: 710-74437321033
L2 = Thermo_Library:L-0603; OC_MOUSER: 710-742792641
L3 = thermo:WE-CNSW; OC_MOUSER: 710-744232090
L4 = Thermo_Library:L-0603; OC_MOUSER: 81-BLM18EG221SN1D
L5 = Thermo_Library:L-1210; OC_MOUSER: 871-B82422H1103K
Q1 = thermo:ECX-1210
R1 = rcl:R-EU_: RESISTOR, European symbol; OC_MOUSER: 603-RC0603FR-0710RL
R2 = rcl:R-EU_: RESISTOR, European symbol; OC_MOUSER: 279-CPF0805B25KE1
R3 = rcl:R-EU_: RESISTOR, European symbol; OC_MOUSER: 652-CR0603FX-2700ELF
R4 R5 = rcl:R-EU_: RESISTOR, European symbol; OC_FARNELL: 2447144
R6 = rcl:R-EU_: RESISTOR, European symbol; OC_MOUSER: 603-RC0603FR-07200KL
R7 = rcl:R-EU_: RESISTOR, European symbol; OC_MOUSER: 652-CR0603-FX-2001LF
R8 = rcl:R-EU_: RESISTOR, European symbol; OC_MOUSER: 660-RK73H1JTTD1541F
R9 = rcl:R-EU_: RESISTOR, European symbol; OC_MOUSER: 754-RR1220P-6982D-M
R10 R24-R33 = rcl:R-EU_: RESISTOR, European symbol; OC_MOUSER: 603-RC0603JR-070RL
R11 = rcl:R-EU_: RESISTOR, European symbol; OC_MOUSER: 603-RC0603FR-07301KL
R12 = rcl:R-EU_: RESISTOR, European symbol; OC_MOUSER: 603-RC0603FR-07324KL
R13 R16 R21 R22 R34 R35 R37 R43-R47 R53-R57 = rcl:R-EU_: RESISTOR, European symbol; OC_MOUSER: 603-RC0603FR-071ML
R14 = rcl:R-EU_: RESISTOR, European symbol; OC_MOUSER: 652-CRM2010FXR100ELF
R15 = rcl:R-EU_: RESISTOR, European symbol; OC_MOUSER: 603-RC0603FR-072M2L
R17 = rcl:R-EU_: RESISTOR, European symbol; OC_MOUSER: 603-RC0603FR-071M8L
R18 = rcl:R-EU_: RESISTOR, European symbol; OC_MOUSER: 603-RC0603FR-074K7L
R19 R36 = rcl:R-EU_: RESISTOR, European symbol
R20 = rcl:R-EU_: RESISTOR, European symbol; OC_MOUSER: 603-RC0603FR-07330RL
R23 = rcl:R-EU_: RESISTOR, European symbol; OC_MOUSER: 603-RC0603FR-0710KL
R38-R42 R48-R52 = rcl:R-EU_: RESISTOR, European symbol; OC_MOUSER: 279-CPF0603B4K7E1
SV1 = con-harting-ml:ML20: HARTING; OC_MOUSER: 538-70246-2004; OC_NEWARK: unknown
T1 = thermo:PMOS: MOSFET-Transistor, p-Kanal, -3.1 A, -20 V, 90 mohm, -4.5 V, -400 mV; OC_MOUSER: 781-SI2301CDS-T1-GE3
T2-T12 = Thermo_Library:NMOS; OC_MOUSER: 726-SP000917562
X1 = Thermo_Library:B3S-1000; OC_MOUSER: 653-B3S-1000
X2 = thermo:MOLEX_1MM_FPC
X3 = thermo:IGRID-20; OC_MOUSER: 538-501645-2020

## Net classes
1 USB_DATA: width 0.191 mm, drill 0.25 mm, clearance 0.191 mm

## Board
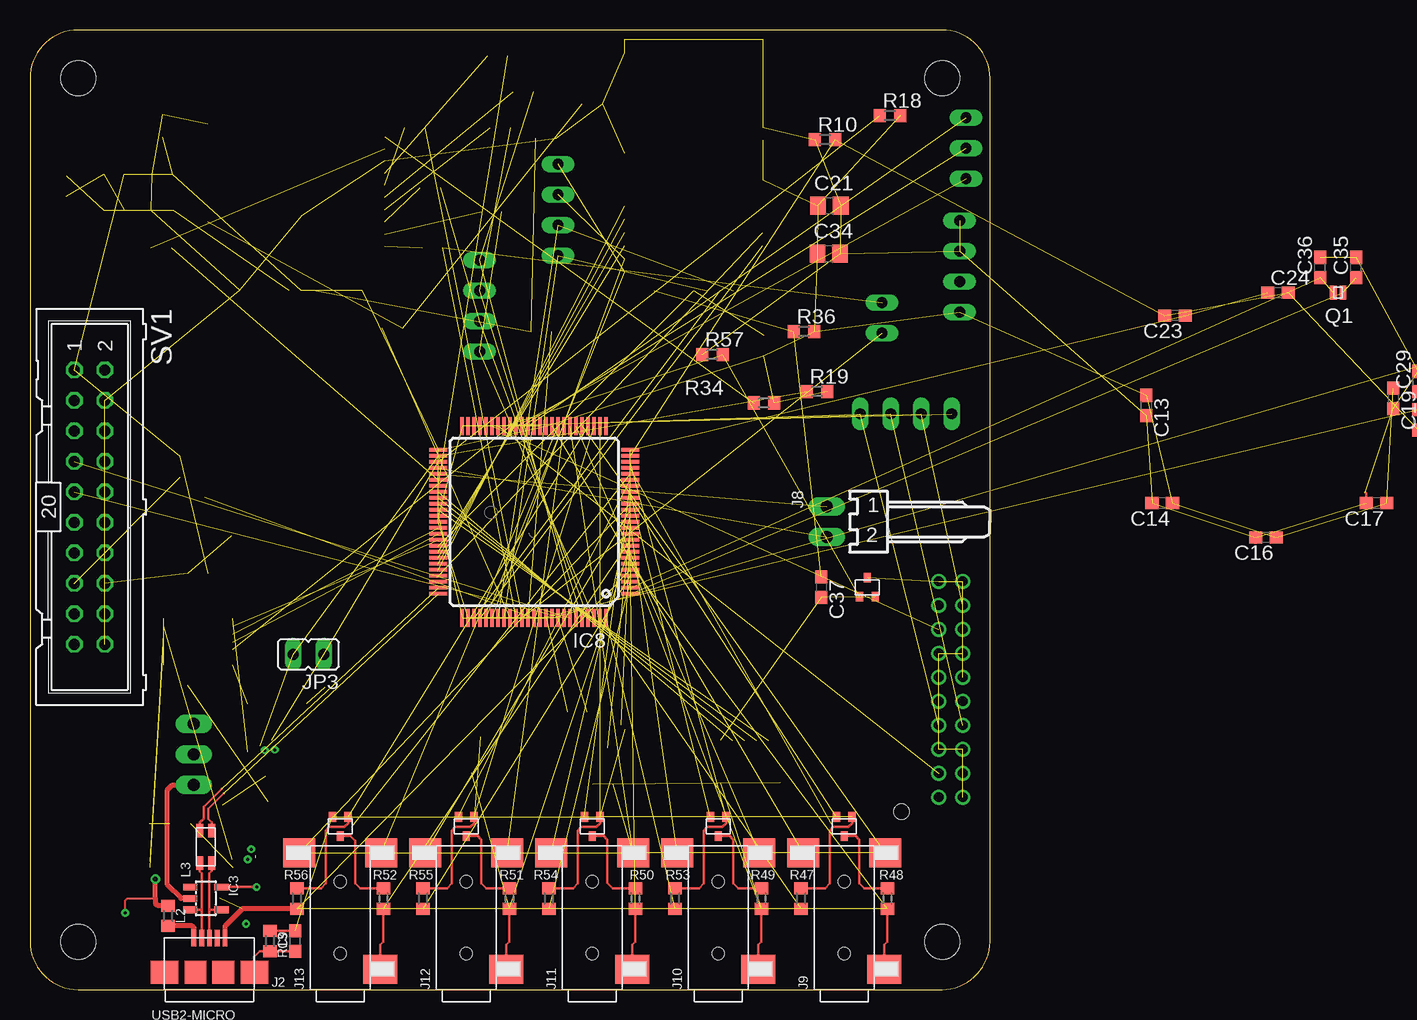
[diagram p4: board, top side]
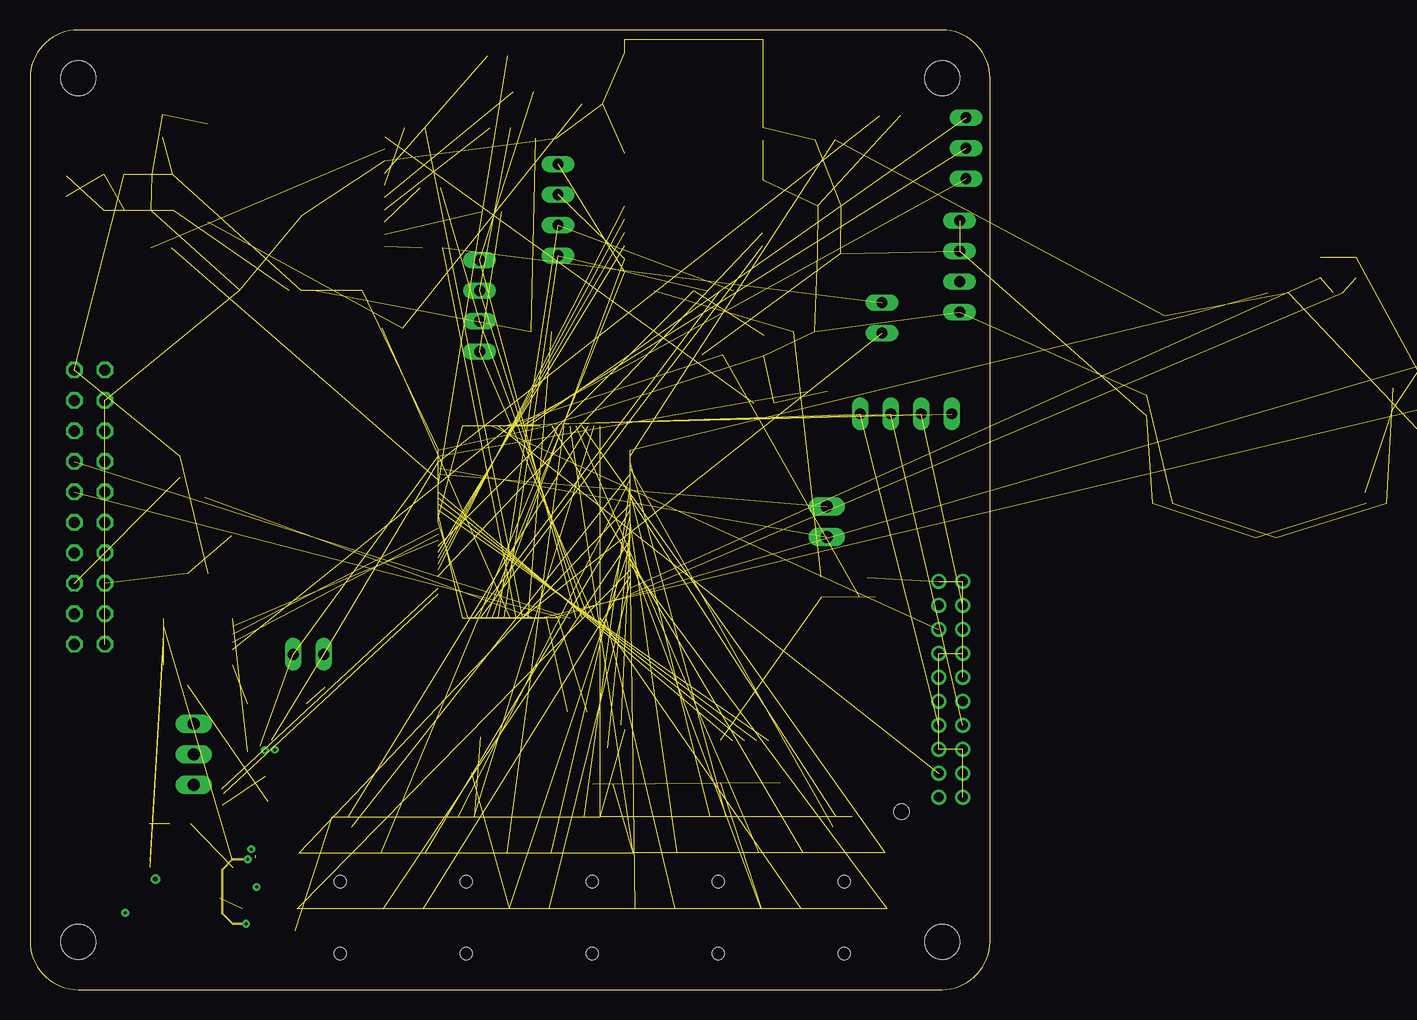
[diagram p5: board, inner layer Route2]
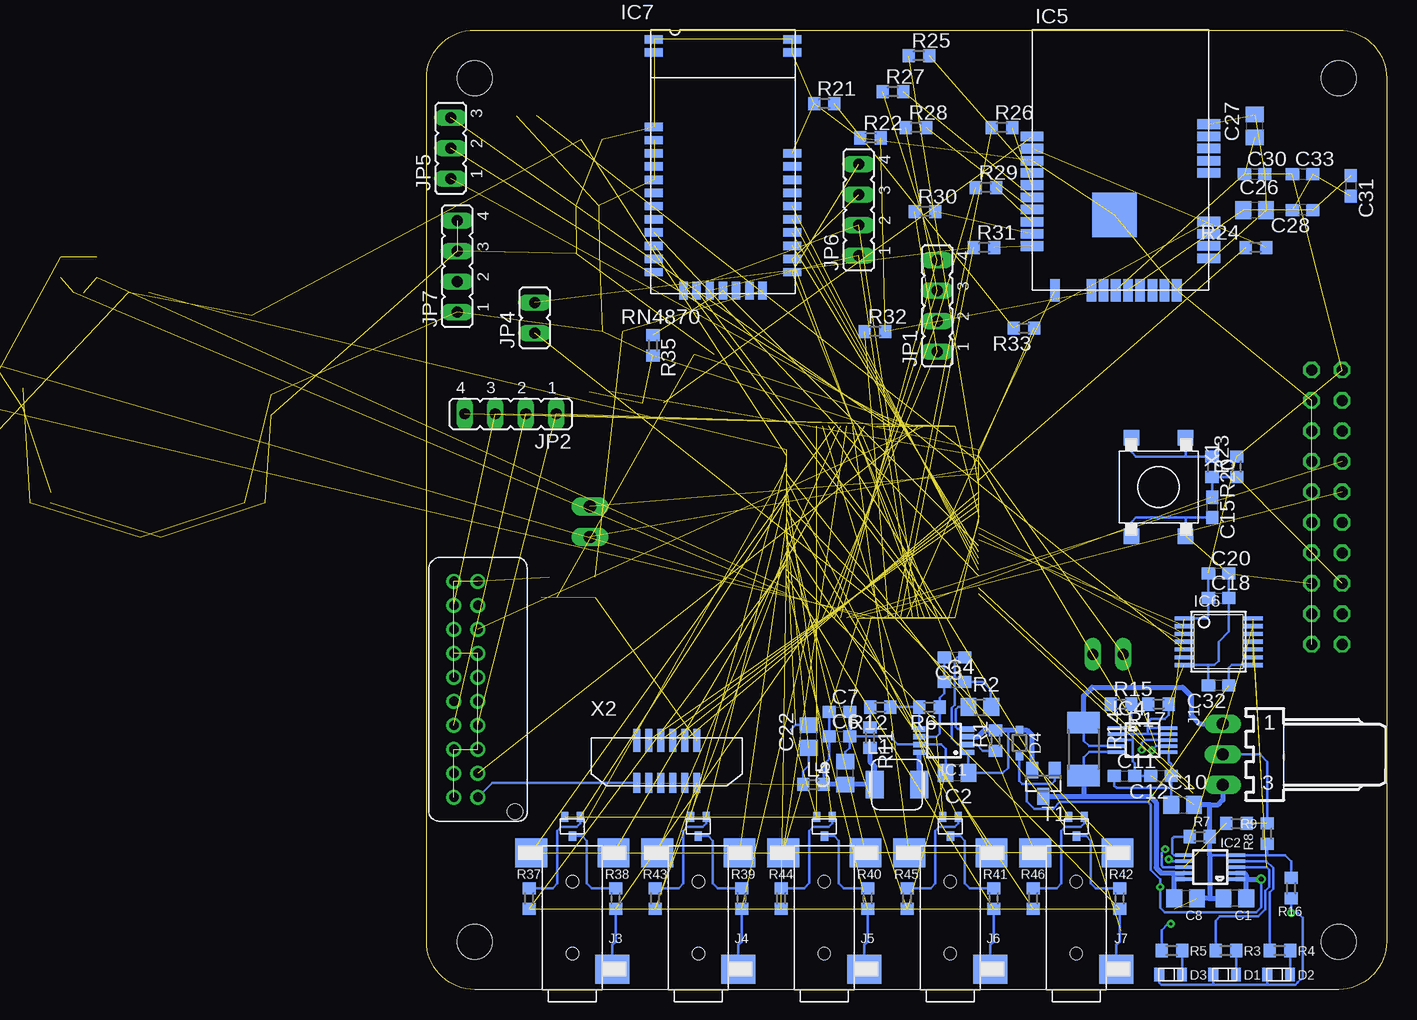
[diagram p6: board, bottom side, seen from below]

Size 80 x 80 mm. Coordinates in mm from the lower left corner, seen from the top.
Outline: 80,4 80,76 arc90 76,80 4,80 arc90 0,76 0,4 arc90 4,0 76,0 arc90 80,4
Copper layers (1+2*15+16): Top 0.035mm / dielectric 0.288mm / Route2 0.035mm / dielectric 0.71mm / Route15 0.035mm / dielectric 0.288mm / Bottom 0.035mm
Design rules "Eagle_WEdirekt_150_check *": minimum track width 0.15mm, minimum drill 0.2mm, track to track 0.15mm, track to pad 0.15mm, pad to pad 0.2mm, via to via 0.15mm, smd to smd 0.2mm, copper to edge 0.3mm, drill to drill 0.6mm, minimum pad ring 0.225mm, minimum via ring 0.2mm, stop-mask expansion 0.075mm, vias tented up to drill 0mil, thermal gap 0.3mm
Holes 2.9 mm at 76,4 4,4 4,76 76,76

### Footprints (pad centres in the part's own frame; a part is rotated, then mirrored left to right if it is on the bottom)
C0805 = smd 1.3 x 1.5: 1 -0.95,0; 2 0.95,0
C0603 = smd 1.1 x 1: 1 -0.85,0; 2 0.85,0
LED_2012 = smd 0.8 x 1.1: 1 -0.95,0; 2 0.95,0
SOD323 = smd 0.8 x 0.6: 1 -1.05,0; 2 1.05,0
MSOP8 = smd 0.45 x 1: 1 -0.975,-2.05; 2 -0.325,-2.05; 3 0.325,-2.05; 4 0.975,-2.05; 5 0.975,2.05; 6 0.325,2.05; 7 -0.325,2.05; 8 -0.975,2.05
MSOP10 = smd 0.3 x 1.4: 1 -1,-2.2; 2 -0.5,-2.2; 3 0,-2.2; 4 0.5,-2.2; 5 1,-2.2; 6 1,2.2; 7 0.5,2.2; 8 0,2.2; 9 -0.5,2.2; 10 -1,2.2
SOT23-5L = smd 0.55 x 1.2: 1 -0.95,-1.3; 2 0,-1.3; 3 0.95,-1.3; 4 0.95,1.3; 5 -0.95,1.3
ATWINC15X0-MODULE = smd 1.9 x 0.8: 1 14.73,2.67; 2 14.73,3.686; 3 14.73,4.702; 4 14.73,5.718; 5 14.73,9.782; 6 14.73,10.798; 7 14.73,11.814; 8 14.73,12.83; 9 14.73,13.846; 10 0,12.824; 11 0,11.808; 12 0,10.792; 13 0,9.776; 14 0,8.76; 15 0,7.744; 16 0,6.728; 17 0,5.712; 18 0,4.696; 19 0,3.68 | smd 0.8 x 1.9: 20 1.9,0; 21 4.948,0; 22 5.964,0; 23 6.98,0; 24 7.996,0; 25 9.012,0; 26 10.028,0; 27 11.044,0; 28 12.06,0 | smd 3.7 x 3.7: 29 6.88,6.27
TSSOP14 = smd 0.35 x 1.6: 1 -1.95,-2.875; 2 -1.3,-2.875; 3 -0.65,-2.875; 4 0,-2.875; 5 0.65,-2.875; 6 1.3,-2.875; 7 1.95,-2.875; 8 1.95,2.875; 9 1.3,2.875; 10 0.65,2.875; 11 0,2.875; 12 -0.65,2.875; 13 -1.3,2.875; 14 -1.95,2.875
RN4870-MODULE = smd 1.5 x 0.7: 1 -6.1,12.31; 2 -6.1,11.21; 3 -6.1,5.01; 4 -6.1,3.91; 5 -6.1,2.81; 6 -6.1,1.71; 7 -6.1,0.61; 8 -6.1,-0.49; 9 -6.1,-1.59; 10 -6.1,-2.69; 11 -6.1,-3.79; 12 -6.1,-4.89; 13 -6.1,-5.99; 14 -6.1,-7.09; 22 5.4,-7.09; 23 5.4,-5.99; 24 5.4,-4.89; 25 5.4,-3.79; 26 5.4,-2.69; 27 5.4,-1.59; 28 5.4,-0.49; 29 5.4,0.61; 30 5.4,1.71; 31 5.4,2.81; 32 5.4,11.21; 33 5.4,12.31 | smd 0.7 x 1.5: 15 -3.65,-8.64; 16 -2.55,-8.64; 17 -1.45,-8.64; 18 -0.35,-8.64; 19 0.75,-8.64; 20 1.85,-8.64; 21 2.95,-8.64
TQFP100 = smd 1.5 x 0.3: 1 -8,6; 2 -8,5.5; 3 -8,5; 4 -8,4.5; 5 -8,4; 6 -8,3.5; 7 -8,3; 8 -8,2.5; 9 -8,2; 10 -8,1.5; 11 -8,1; 12 -8,0.5; 13 -8,0; 14 -8,-0.5; 15 -8,-1; 16 -8,-1.5; 17 -8,-2; 18 -8,-2.5; 19 -8,-3; 20 -8,-3.5; 21 -8,-4; 22 -8,-4.5; 23 -8,-5; 24 -8,-5.5; 25 -8,-6; 51 8,-6; 52 8,-5.5; 53 8,-5; 54 8,-4.5; 55 8,-4; 56 8,-3.5; 57 8,-3; 58 8,-2.5; 59 8,-2; 60 8,-1.5; 61 8,-1; 62 8,-0.5; 63 8,0; 64 8,0.5; 65 8,1; 66 8,1.5; 67 8,2; 68 8,2.5; 69 8,3; 70 8,3.5; 71 8,4; 72 8,4.5; 73 8,5; 74 8,5.5; 75 8,6 | smd 0.3 x 1.5: 26 -6,-8; 27 -5.5,-8; 28 -5,-8; 29 -4.5,-8; 30 -4,-8; 31 -3.5,-8; 32 -3,-8; 33 -2.5,-8; 34 -2,-8; 35 -1.5,-8; 36 -1,-8; 37 -0.5,-8; 38 0,-8; 39 0.5,-8; 40 1,-8; 41 1.5,-8; 42 2,-8; 43 2.5,-8; 44 3,-8; 45 3.5,-8; 46 4,-8; 47 4.5,-8; 48 5,-8; 49 5.5,-8; 50 6,-8; 76 6,8; 77 5.5,8; 78 5,8; 79 4.5,8; 80 4,8; 81 3.5,8; 82 3,8; 83 2.5,8; 84 2,8; 85 1.5,8; 86 1,8; 87 0.5,8; 88 0,8; 89 -0.5,8; 90 -1,8; 91 -1.5,8; 92 -2,8; 93 -2.5,8; 94 -3,8; 95 -3.5,8; 96 -4,8; 97 -4.5,8; 98 -5,8; 99 -5.5,8; 100 -6,8
7395-03 = drill 1.016 long: 1 2.54,0; 2 0,0; 3 -2.54,0
USB-2-MICRO = smd 0.4 x 1.4: 1 -1.3,4.3; 2 -0.65,4.3; 3 0,4.3; 4 0.65,4.3; 5 1.3,4.3 | smd 2.3 x 1.9: 6 -3.75,1.45; 9 3.75,1.45 | smd 1.8 x 1.9: 7 -1.15,1.45; 8 1.15,1.45
2.5MM-AUDIO-JACK-MONO = smd 2.4 x 2.85: 1 1.7,-3.325 | smd 2.4 x 2.65: 2 11.4,-3.425; 3 11.4,3.425 | hole 1: 3,0; 9,0
7395-02 = drill 1.016 long: 1 1.27,0; 2 -1.27,0
2.5MM-AUDIO-JACK-MONO-2 = smd 2.4 x 2.85: 1 1.7,-3.325 | smd 2.4 x 2.65: 2 11.4,-3.425; 3 11.4,3.425
JP4 = drill 0.914 long: 1 -3.81,0; 2 -1.27,0; 3 1.27,0; 4 3.81,0
JP1 = drill 0.914 long: 1 0,-1.27; 2 0,1.27
JP2 = drill 0.914 long: 1 -2.54,0; 2 0,0; 3 2.54,0
WE-LHMI = smd 1.5 x 2.3: 1 -1.85,0; 2 1.85,0
L0603 = smd 1 x 1.1: 1 -0.85,0; 2 0.85,0
WE-CNSW = smd 1.1 x 0.6: 1 -1.35,-0.5; 2 1.35,-0.5; 3 1.35,0.5; 4 -1.35,0.5
L-1210 = smd 1.15 x 2.7: 1 -1.625,0; 2 1.625,0
ECX-1210 = smd 0.575 x 1.14: 1 -0.412,0; 2 0.412,0
R0603 = smd 1 x 1.1: 1 -0.85,0; 2 0.85,0
R0805 = smd 1.3 x 1.5: 1 -0.95,0; 2 0.95,0
R5025 = smd 1.8 x 2.7: 1 -2.2,0; 2 2.2,0
ML20 = drill 0.914 octagon: 1 -11.43,-1.27; 2 -11.43,1.27; 3 -8.89,-1.27; 4 -8.89,1.27; 5 -6.35,-1.27; 6 -6.35,1.27; 7 -3.81,-1.27; 8 -3.81,1.27; 9 -1.27,-1.27; 10 -1.27,1.27; 11 1.27,-1.27; 12 1.27,1.27; 13 3.81,-1.27; 14 3.81,1.27; 15 6.35,-1.27; 16 6.35,1.27; 17 8.89,-1.27; 18 8.89,1.27; 19 11.43,-1.27; 20 11.43,1.27
SOT23 = smd 1 x 1.4: 1 -0.95,-1.1; 2 0.95,-1.1; 3 0,1.1
SOT-323 = smd 0.6 x 0.8: 1 -0.65,0; 2 0.65,0; 3 0,1.6
B3S = smd 1.3 x 1.3: 1 4.1,-2.25; 2 -4.1,-2.25; 3 4.1,2.25; 4 -4.1,2.25
1MM_FPC_ZIF = smd 0.6 x 1.9: 1 -2.5,1.775; 2 -1.5,1.775; 3 -0.5,1.775; 4 0.5,1.775; 5 1.5,1.775; 6 2.5,1.775 | smd 0.6 x 1.65: 7 -2.5,-1.775; 8 -1.5,-1.775; 9 -0.5,-1.775; 10 0.5,-1.775; 11 1.5,-1.775; 12 2.5,-1.775
I-GRID-20 = drill 0.8: 1 -9,2; 2 -9,0; 3 -7,2; 4 -7,0; 5 -5,2; 6 -5,0; 7 -3,2; 8 -3,0; 9 -1,2; 10 -1,0; 11 1,2; 12 1,0; 13 3,2; 14 3,0; 15 5,2; 16 5,0; 17 7,2; 18 7,0; 19 9,2; 20 9,0 | hole 1.3: -10.2,-3.1

### Placement (x,y rotation side)
C1  12.65,7.6 180 bottom
C2  35.8,18.05 180 bottom
C3  36,27.7 180 bottom
C4  36,25.65 0 bottom
C5  45.1,18.05 90 bottom
C6  45.6,21.1 0 bottom
C7  45.6,23.15 0 bottom
C8  16.75,7.6 0 bottom
C9  22.1,4.05 90 top
C10  17,15.4 0 bottom
C11  21.85,17.8 0 bottom
C12  18.8,17.8 180 bottom
C13  93,48.7 270 top  (outside the outline)
C14  94.35,40.55 180 top  (outside the outline)
C15  14.55,40.2 270 bottom
C16  103,37.7 180 top  (outside the outline)
C17  112.2,40.55 180 top  (outside the outline)
C18  14,32.65 0 bottom
C19  113.6,49.3 270 top  (outside the outline)
C20  14,34.7 0 bottom
C21  66.61,65.35 0 top
C22  48.15,21.1 90 bottom
C23  95.42,56.2 180 top  (outside the outline)
C24  104,58.1 0 top  (outside the outline)
C25  115.7,47.5 270 top  (outside the outline)
C26  11,65 0 bottom
C27  11,72 90 bottom
C28  7,65 180 bottom
C29  115.7,50.7 90 top  (outside the outline)
C30  11,68 0 bottom
C31  3,67 270 bottom
C32  14,25.35 180 bottom
C33  7,68 0 bottom
C34  66.56,61.35 0 top
C35  110.5,60.2 90 top  (outside the outline)
C36  107.5,60.2 90 top  (outside the outline)
C37  65.94,33.54 270 top
D1  13.5,1.25 180 bottom
D2  9,1.25 180 bottom
D3  18,1.25 180 bottom
D4  30.6,20.55 270 bottom
IC1  36.9,20.75 90 bottom
IC2  14.7,10.2 90 bottom
IC3  14.65,7.6 270 top
IC4  20.35,20.8 270 bottom
IC5  29.55,58.3 0 bottom
IC6  14,29 270 bottom
IC7  54.95,66.9 0 bottom
IC8  42,39 180 top
J1  13.65,19.6 90 bottom
J2  14.95,0 0 top
J3  67.85,0 90 bottom
J4  57.35,0 90 bottom
J5  46.85,0 90 bottom
J6  36.35,0 90 bottom
J7  25.85,0 90 bottom
J8  66.39,39 90 top
J9  67.85,0 90 top
J10  57.35,0 90 top
J11  46.85,0 90 top
J12  36.35,0 90 top
J13  25.85,0 90 top
JP1  37.46,57 90 bottom
JP2  73,48 180 bottom
JP3  23.2,27.95 90 top
JP4  71,56 0 bottom
JP5  78,70.14 90 bottom
JP6  44,65 90 bottom
JP7  77.46,60.3 90 bottom
L1  40.8,17.1 0 bottom
L2  11.5,6.15 270 top
L3  14.65,11.9 90 top
L4  47.75,17.1 0 bottom
L5  118.38,51.15 270 top  (outside the outline)
Q1  109,58.1 180 top  (outside the outline)
R1  32.6,20.75 90 bottom
R2  33.9,23.55 0 bottom
R3  13.4,3.25 180 bottom
R4  8.9,3.25 180 bottom
R5  17.9,3.25 180 bottom
R6  38.1,23.55 180 bottom
R7  15.57,12.75 180 bottom
R8  12.5,13.85 180 bottom
R9  9.95,13 90 bottom
R10  66.26,70.86 0 top
R11  43.05,21 270 bottom
R12  42.2,23.55 180 bottom
R13  20,4.05 270 top
R14  25.25,20.05 270 bottom
R15  22.15,23.8 0 bottom
R16  7.95,8.45 270 bottom
R17  19,23.8 180 bottom
R18  71.66,72.86 0 top
R19  65.58,49.86 0 top
R20  14.55,43.6 270 bottom
R21  46.86,73.86 0 bottom
R22  43,71 0 bottom
R23  12.5,43.6 90 bottom
R24  10.9,61.86 0 bottom
R25  38.98,77.86 0 bottom
R26  32.06,71.86 0 bottom
R27  41.14,74.86 0 bottom
R28  39.22,71.86 0 bottom
R29  33.38,66.86 0 bottom
R30  38.46,64.86 0 bottom
R31  33.54,61.86 0 bottom
R32  42.62,54.86 0 bottom
R33  30.22,55.14 180 bottom
R34  61.15,48.91 0 top
R35  61.14,53.7 270 bottom
R36  64.5,54.86 0 top
R37  71.45,7.6 90 bottom
R38  64.25,7.6 90 bottom
R39  53.75,7.6 90 bottom
R40  43.25,7.6 90 bottom
R41  32.75,7.6 90 bottom
R42  22.25,7.6 90 bottom
R43  60.95,7.6 90 bottom
R44  50.45,7.6 90 bottom
R45  39.95,7.6 90 bottom
R46  29.45,7.6 90 bottom
R47  64.25,7.6 90 top
R48  71.45,7.6 90 top
R49  60.95,7.6 90 top
R50  50.45,7.6 90 top
R51  39.95,7.6 90 top
R52  29.45,7.6 90 top
R53  53.75,7.6 90 top
R54  43.25,7.6 90 top
R55  32.75,7.6 90 top
R56  22.25,7.6 90 top
R57  56.86,52.94 0 top
SV1  4.97,40.22 270 top
T1  28.6,17.2 180 bottom
T2  67.85,14.4 180 bottom
T3  57.35,14.4 180 bottom
T4  46.85,14.4 180 bottom
T5  36.35,14.4 180 bottom
T6  25.85,14.4 180 bottom
T7  67.85,14.4 180 top
T8  57.35,14.4 180 top
T9  46.85,14.4 180 top
T10  36.35,14.4 180 top
T11  25.85,14.4 180 top
T12  69.78,32.75 0 top
X1  19,41.9 270 bottom
X2  60,19 0 bottom
X3  75.73,25.04 90 bottom

### Tracks (layer width: path | path; a pad name or v marks a point on that pad's centre or on a via)
!OLED_RESET  (1 unrouted)
!OLED_SPI_CS  (2 unrouted)
!PG!_TRANS  (1 unrouted)
!RESET!  (2 unrouted)
  Bottom 0.2: R23.1 R20.2 C15.1
!RESET!_B
  Bottom 0.2: X1.2 21.25,44.8 20.9,44.45 16.75,44.45 | 16.75,44.45 R20.1 | X1.4 16.75,44.45
+3V3  (31 unrouted)
  Bottom 0.2: C7.1 C6.1 46.45,19.25 46.9,18.8 L4.2 | C20.1 C18.1 14.85,31.15 15.05,30.95 IC6.1 | C11.1 22.7,17 22.5,16.8 17.95,16.8 | C10.1 17.95,16.8 | IC4.6 18.15,19 17.95,18.8 C12.1 17.95,16.8 | X3.2 74.55,17.23 X2.7
  Bottom 0.4: R11.2 43.05,19 42.65,18.6 L1.1 C5.1 L4.2
+3V3_ANA  (14 unrouted)
  Bottom 0.2: L4.1 48.6,18.25 48.15,18.7 C22.1
AD_CH2+
  Bottom 0.2: R15.2 R17.2 | R15.2 21.35,23.75 | IC4.1 21.6,21.8 21.3,22.1 R15.2
AD_SCL  (via drill 0.25)  (3 unrouted)
  Bottom 0.2: v20.4,20 20.4,20.55 20.15,20.8 IC4.8
AD_SDA  (via drill 0.25)  (3 unrouted)
  Bottom 0.2: IC4.7 19.2,20.3 v19.55,19.95
AGND  (18 unrouted)
  Top 0.2: C9.2 R13.1
  Bottom 0.2: IC1.6 37.52,21.07 37.25,21.35 R6.1 37.25,24.3 36.85,24.7 C4.1 C3.2 | C22.2 49.25,22.05 49.6,21.7
BT_!RESET!  (2 unrouted)
BT_LINK_DROP  (1 unrouted)
BT_MODE  (2 unrouted)
BT_PAIRING_KEY  (1 unrouted)
BT_RSSI_IND  (1 unrouted)
BT_RX_IND  (1 unrouted)
BT_STATUS_1  (1 unrouted)
BT_STATUS_2  (1 unrouted)
BT_TX_IND  (1 unrouted)
BT_UART_CTS  (2 unrouted)
BT_UART_RTS  (2 unrouted)
BT_UART_RX  (2 unrouted)
BT_UART_TX  (2 unrouted)
BUCK_FB
  Bottom 0.2: IC1.5 R6.2 R12.1
BUCK_FB_R
  Bottom 0.2: R11.1 R12.2
BUCK_LX
  Bottom 0.4: L1.2 IC1.8
BUCK_RC_C
  Bottom 0.2: R2.2 33,23.6 33,25 33.65,25.65 C4.2
BUCK_RC_R
  Bottom 0.2: R2.1 35.7,23.55 35.9,23.35 35.9,21.9 35.73,21.73 IC1.4
BUCK_V+
  Bottom 0.2: 31.55,21.6 31.55,18.5 32,18.05 C2.1 IC1.1
  Bottom 0.4: IC1.3 34.08,21.07 33.55,21.6 R1.2 31.55,21.6 D4.1 29.95,21.6 29.55,21.2 T1.2
BUCK_VCC
  Bottom 0.2: R1.1 33.65,19.9 34.17,20.43 IC1.2 35.73,20.43 36.25,20.95 36.25,23.5 36,23.75 36,27.5 35.8,27.7 C3.1
CHARGER_!PG!  (via drill 0.25)  (1 unrouted)
  Route2 0.191: 16,10 16.84,10.84 v18.16,10.84
  Route2 0.2: 16,10 16,6.35 16.88,5.47 v18,5.47
  Bottom 0.191: v18,5.47 18.23,5.47 18.75,4.95 R5.2
  Bottom 0.2: IC2.7 18.01,10.7 v18.16,10.84
CHARGER_!PG!_LED
  Bottom 0.2: D3.1 R5.1
CHARGER_NTC  (1 unrouted)
  Bottom 0.2: R9.2 9.95,19 10.55,19.6 J1.2
CHARGER_PROG
  Bottom 0.2: IC2.6 17.7,11.2 17.85,11.35 17.85,12.6 17.7,12.75 R7.2
CHARGER_STAT1  (1 unrouted)
  Bottom 0.191: R3.2 14.25,5.75 13.89,6.11 10.71,6.11 10.11,6.71 10.11,8.25 9.8,8.55 9.8,10 10,10.2 IC2.3
CHARGER_STAT1_LED
  Bottom 0.2: D1.1 R3.1
CHARGER_STAT2  (1 unrouted)
  Bottom 0.191: R4.2 9.75,8.12 9.46,8.41 9.46,10.14 10.02,10.7 IC2.4
CHARGER_STAT2_LED
  Bottom 0.2: D2.1 R4.1
CHARGER_THERM  (via drill 0.25)  (2 unrouted)
  Bottom 0.2: IC2.8 18.61,10.2 18.75,10.34 18.75,11.2 | 18.75,11 18.75,11.4 v18.45,11.7
CHARGER_VBAT_MEAS
  Bottom 0.2: R14.2 25.25,19.35 24.8,19.8 IC4.5
  Bottom 0.4: IC2.10 17.7,9.2 | C8.1 17.7,9.2 | 17.7,9.7 IC2.9 | 17.7,9.7 18.75,9.7 19.2,10.15 19.2,15.6 19.7,16.1 25.25,16.1 | 17.7,9.2 17.7,9.7 | R14.2 25.25,16.1 | T1.3 25.25,16.1
CHARGER_VUSB_FIL  (via drill 0.25, 0.4)  (3 unrouted)
  Top 0.152: v7.95,6.4 7.95,7.45 8.1,7.6 10.45,7.6
  Top 0.2: v18.88,8.55 IC3.5
  Top 0.4: L2.1 10.65,7 10.45,7.2 10.45,7.6 v10.45,9.2
  Bottom 0.2: IC6.8 12.9,27.05 13.15,26.8 C32.1 | 9.95,0.4 7.6,0.4 7.4,0.6 7,1 7,6 7.4,6.4 v7.95,6.4 R16.2 | 14.45,0.4 9.95,0.4 | 14.45,0.4 18.8,0.4 18.95,0.55 D3.2 | D4.2 30.6,17.4 30.35,17.15 30,17.15 | 30,17.15 27.9,17.15 27.65,17.4 T1.1 | v10.45,9.2 10.45,6.85 10.85,6.45 18.5,6.45 18.88,6.83 v18.88,8.55 18.88,9.19 19.65,9.96 19.65,15.41 19.87,15.63 27.22,15.63 27.8,15.05 29.35,15.05 30,15.7 30,17.15 | D2.2 9.95,0.4 | D1.2 14.45,0.4
  Bottom 0.4: IC2.2 11.85,9.7 11.7,9.55 11.7,9.2 | 11.7,9.2 IC2.1 | 11.7,9.2 v10.45,9.2 | C1.1 11.7,9.2
EXT_PWM_0  (1 unrouted)
EXT_PWM_1  (1 unrouted)
GND  (63 unrouted)
  Top 0.2: C17.2 111.35,41.35 111.26,41.44
  Top 0.4: IC3.2 12.6,7.6 11.45,8.75 11.45,16.65 11.86,17.06 J1.3 | J2.5 16.25,5.3 17.7,6.75 R56.1
  Bottom 0.191: C11.2 C12.2
  Bottom 0.2: C2.2 36.75,20.05 37.12,20.43 IC1.7 40.73,20.43 41.4,21.1 C6.2 | 16.75,39.35 C15.2 | 16.75,39.35 20.9,39.35 21.25,39 X1.1 | X1.3 16.75,39.35 | 14.72,11.2 IC2.5 9.95,11.2 | C5.2 45.1,19.8 44.75,20.15 C6.2 | C6.2 C7.2 | C11.2 21,18.86 21.15,19 21.15,20.8 | C20.2 C18.2 13.15,29.85 14,29 14,27.4 14.35,27.05 14.85,27.05 | 14.85,27.05 IC6.7 | C32.2 14.85,27.05 | 21.15,20.8 IC4.3 | 19.9,21.3 21.15,21.3 | 19.9,21.3 IC4.9 | 21.15,21.3 IC4.2 | 21.15,20.8 21.15,21.3 | R17.1 18.15,22.9 18.5,22.55 19.6,22.55 19.9,22.25 19.9,21.8 | 19.9,21.8 19.9,21.3 | IC4.10 19.9,21.8 | 10,12.1 R9.1 9.95,11.2 | R16.1 7.95,10.7 8.45,11.2 9.95,11.2
  Bottom 0.4: 14.75,7.6 C1.2 | 14.75,7.6 C8.2 | 14.75,7.6 14.72,7.62 14.72,11.2 R7.1 14.72,15.4 | J1.3 13.65,15.8 14.05,15.4 14.72,15.4 | 14.72,15.4 C10.2
MISO_NC  (1 unrouted)
OLED_D/C  (1 unrouted)
OLED_EN  (2 unrouted)
OLED_EN_DRAIN  (10 unrouted)
OLED_SPI_MOSI  (2 unrouted)
OLED_SPI_SCLK  (2 unrouted)
RES0  (1 unrouted)
RES1  (1 unrouted)
RES2  (1 unrouted)
SENSOR_EN_0  (1 unrouted)
  Bottom 0.2: R37.2 69.5,8.45 69.1,8.85 69.1,13.25 68.8,13.55 67.5,13.55 67.2,13.85 T2.1
SENSOR_EN_1  (1 unrouted)
  Bottom 0.2: 60.9,8.4 R43.2 59,8.45 58.6,8.85 58.6,13.25 58.3,13.55 57,13.55 56.7,13.85 T3.1
SENSOR_EN_2  (1 unrouted)
  Bottom 0.2: 50.4,8.4 R44.2 48.55,8.45 48.1,8.9 48.1,13.25 47.8,13.55 46.5,13.55 46.2,13.85 T4.1
SENSOR_EN_3  (1 unrouted)
  Bottom 0.2: R45.2 38,8.45 37.6,8.85 37.6,13.25 37.3,13.55 36,13.55 35.7,13.85 T5.1
SENSOR_EN_4  (1 unrouted)
  Bottom 0.2: 29.4,8.4 R46.2 27.5,8.45 27.1,8.85 27.1,13.25 26.8,13.55 25.5,13.55 25.2,13.85 T6.1
SENSOR_EN_5  (1 unrouted)
  Top 0.2: T7.1 68.5,13.85 68.2,13.55 66.95,13.55 66.65,13.25 66.65,8.85 66.25,8.45 R47.2
SENSOR_EN_6  (1 unrouted)
  Top 0.2: T8.1 58,13.85 57.7,13.55 56.45,13.55 56.15,13.25 56.15,8.85 55.75,8.45 R53.2
SENSOR_EN_7  (1 unrouted)
  Top 0.2: T9.1 47.5,13.85 47.2,13.55 45.95,13.55 45.65,13.25 45.65,8.85 45.25,8.45 R54.2
SENSOR_EN_8  (1 unrouted)
  Top 0.2: T10.1 37,13.85 36.7,13.55 35.45,13.55 35.15,13.25 35.15,8.85 34.75,8.45 R55.2
SENSOR_EN_9  (1 unrouted)
  Top 0.2: R56.2 24.25,8.45 24.65,8.85 24.65,13.25 24.95,13.55 26.2,13.55 26.5,13.85 T11.1
SENSOR_IN_0  (1 unrouted)
  Bottom 0.2: R38.1 64.25,4 64.53,3.73 J3.1
SENSOR_IN_0_DRAIN
  Bottom 0.2: R38.2 66.25,8.45 66.65,8.85 66.65,12.4 67.05,12.8 T2.3
SENSOR_IN_1  (1 unrouted)
  Bottom 0.2: R39.1 53.75,4 54.02,3.73 J4.1
SENSOR_IN_1_DRAIN
  Bottom 0.2: R39.2 55.75,8.45 56.15,8.85 56.15,12.4 56.55,12.8 T3.3
SENSOR_IN_2  (1 unrouted)
  Bottom 0.2: R40.1 43.25,4 43.52,3.73 J5.1
SENSOR_IN_2_DRAIN
  Bottom 0.2: T4.3 46.05,12.8 45.65,12.4 45.65,8.85 45.25,8.45 R40.2
SENSOR_IN_3  (1 unrouted)
  Bottom 0.2: R41.1 32.75,4 33.02,3.73 J6.1
SENSOR_IN_3_DRAIN
  Bottom 0.2: T5.3 35.55,12.8 35.15,12.4 35.15,8.85 34.75,8.45 R41.2
SENSOR_IN_4  (1 unrouted)
  Bottom 0.2: R42.1 22.25,4 22.52,3.73 J7.1
SENSOR_IN_4_DRAIN
  Bottom 0.2: T6.3 25.05,12.8 24.65,12.4 24.65,8.85 24.25,8.45 R42.2
SENSOR_IN_5  (1 unrouted)
  Top 0.2: R48.1 71.45,4 71.17,3.73 J9.1
SENSOR_IN_5_DRAIN
  Top 0.2: R48.2 69.5,8.45 69.1,8.85 69.1,12.5 68.8,12.8 T7.3
SENSOR_IN_6  (1 unrouted)
  Top 0.2: R49.1 60.95,4 60.67,3.73 J10.1
SENSOR_IN_6_DRAIN
  Top 0.2: R49.2 59,8.45 58.6,8.85 58.6,12.5 58.3,12.8 T8.3
SENSOR_IN_7  (1 unrouted)
  Top 0.2: R50.1 50.45,4 50.17,3.73 J11.1
SENSOR_IN_7_DRAIN
  Top 0.2: R50.2 48.55,8.45 48.1,8.9 48.1,12.5 47.8,12.8 T9.3
SENSOR_IN_8  (1 unrouted)
  Top 0.2: R51.1 39.95,4 39.67,3.73 J12.1
SENSOR_IN_8_DRAIN
  Top 0.2: R51.2 38,8.45 37.6,8.85 37.6,12.5 37.3,12.8 T10.3
SENSOR_IN_9  (1 unrouted)
  Top 0.2: R52.1 29.45,4 29.18,3.73 J13.1
SENSOR_IN_9_DRAIN
  Top 0.2: R52.2 27.5,8.45 27.1,8.85 27.1,12.4 26.7,12.8 T11.3
SENSOR_INT_0  (1 unrouted)
SENSOR_INT_1  (1 unrouted)
SENSOR_INT_2  (1 unrouted)
SENSOR_INT_3  (1 unrouted)
SENSOR_INT_4  (1 unrouted)
SENSOR_INT_5  (1 unrouted)
SENSOR_INT_6  (1 unrouted)
SENSOR_INT_7  (1 unrouted)
SENSOR_INT_8  (1 unrouted)
SENSOR_INT_9  (1 unrouted)
STAT1_TRANS  (1 unrouted)
STAT2_TRANS  (1 unrouted)
SWDCLK  (1 unrouted)
SWDIO  (1 unrouted)
UI_BUTTON_INT_0  (1 unrouted)
UI_BUTTON_INT_1  (1 unrouted)
UI_BUTTON_INT_2  (1 unrouted)
UI_BUTTON_INT_3  (1 unrouted)
USB_CON_INT_TRANS  (1 unrouted)
USB_D_FIL_N  (1 unrouted)
  Top 0.191: L3.3 14.15,13.94 14.46,14.25 14.46,15.23 15.97,16.74
USB_D_FIL_P  (1 unrouted)
  Top 0.191: L3.2 15.15,13.94 14.84,14.25 14.84,15.07 16.13,16.36
USB_D_N
  Top 0.191: 14.3,6.65 J2.2 | 14.3,6.65 14.3,9.7 14.15,9.85 L3.4 | IC3.3 14.3,6.65
USB_D_P
  Top 0.191: J2.3 14.95,6.65 | 14.95,6.65 14.95,9.7 15.15,9.9 L3.1 | IC3.4 14.95,6.65
USB_SHIELD
  Top 0.2: C9.1 R13.2 19.15,3.2 18.7,2.75 J2.9
USB_VCC
  Top 0.4: J2.1 13.65,5.15 13.5,5.3 L2.2
VBAT  (1 unrouted)
  Bottom 0.2: R14.1 25.25,20.75 24.8,20.3 IC4.4 | R15.1 22.95,23.85
  Bottom 0.4: R14.1 25.25,24.5 24.55,25.2 17,25.2 16.3,24.5 16.3,22.85 15.6,22.15 J1.1
VDDCORE  (3 unrouted)
VDDOUT  (1 unrouted)
WIFI_1P3V_TP  (3 unrouted)
WIFI_CHIP_EN  (1 unrouted)
WIFI_CHIP_EN_D  (2 unrouted)
WIFI_IRQN  (1 unrouted)
WIFI_IRQN_D  (1 unrouted)
WIFI_RESETN  (1 unrouted)
WIFI_RESETN_D  (2 unrouted)
WIFI_SPI_CFG  (1 unrouted)
WIFI_SPI_MISO  (2 unrouted)
WIFI_SPI_MISO_D  (1 unrouted)
WIFI_SPI_MOSI  (2 unrouted)
WIFI_SPI_MOSI_D  (1 unrouted)
WIFI_SPI_SCK  (2 unrouted)
WIFI_SPI_SCK_D  (1 unrouted)
WIFI_SPI_SSN  (2 unrouted)
WIFI_SPI_SSN_D  (1 unrouted)
WIFI_UART1_RXD  (2 unrouted)
WIFI_UART1_RXD_D  (1 unrouted)
WIFI_UART1_TXD  (2 unrouted)
WIFI_UART1_TXD_D  (1 unrouted)
WIFI_WAKE  (1 unrouted)
WIFI_WAKE_D  (1 unrouted)
XIN32  (2 unrouted)
XOUT32  (2 unrouted)